# Altium project PCB_Project.PrjPcb (part 1 of 2)
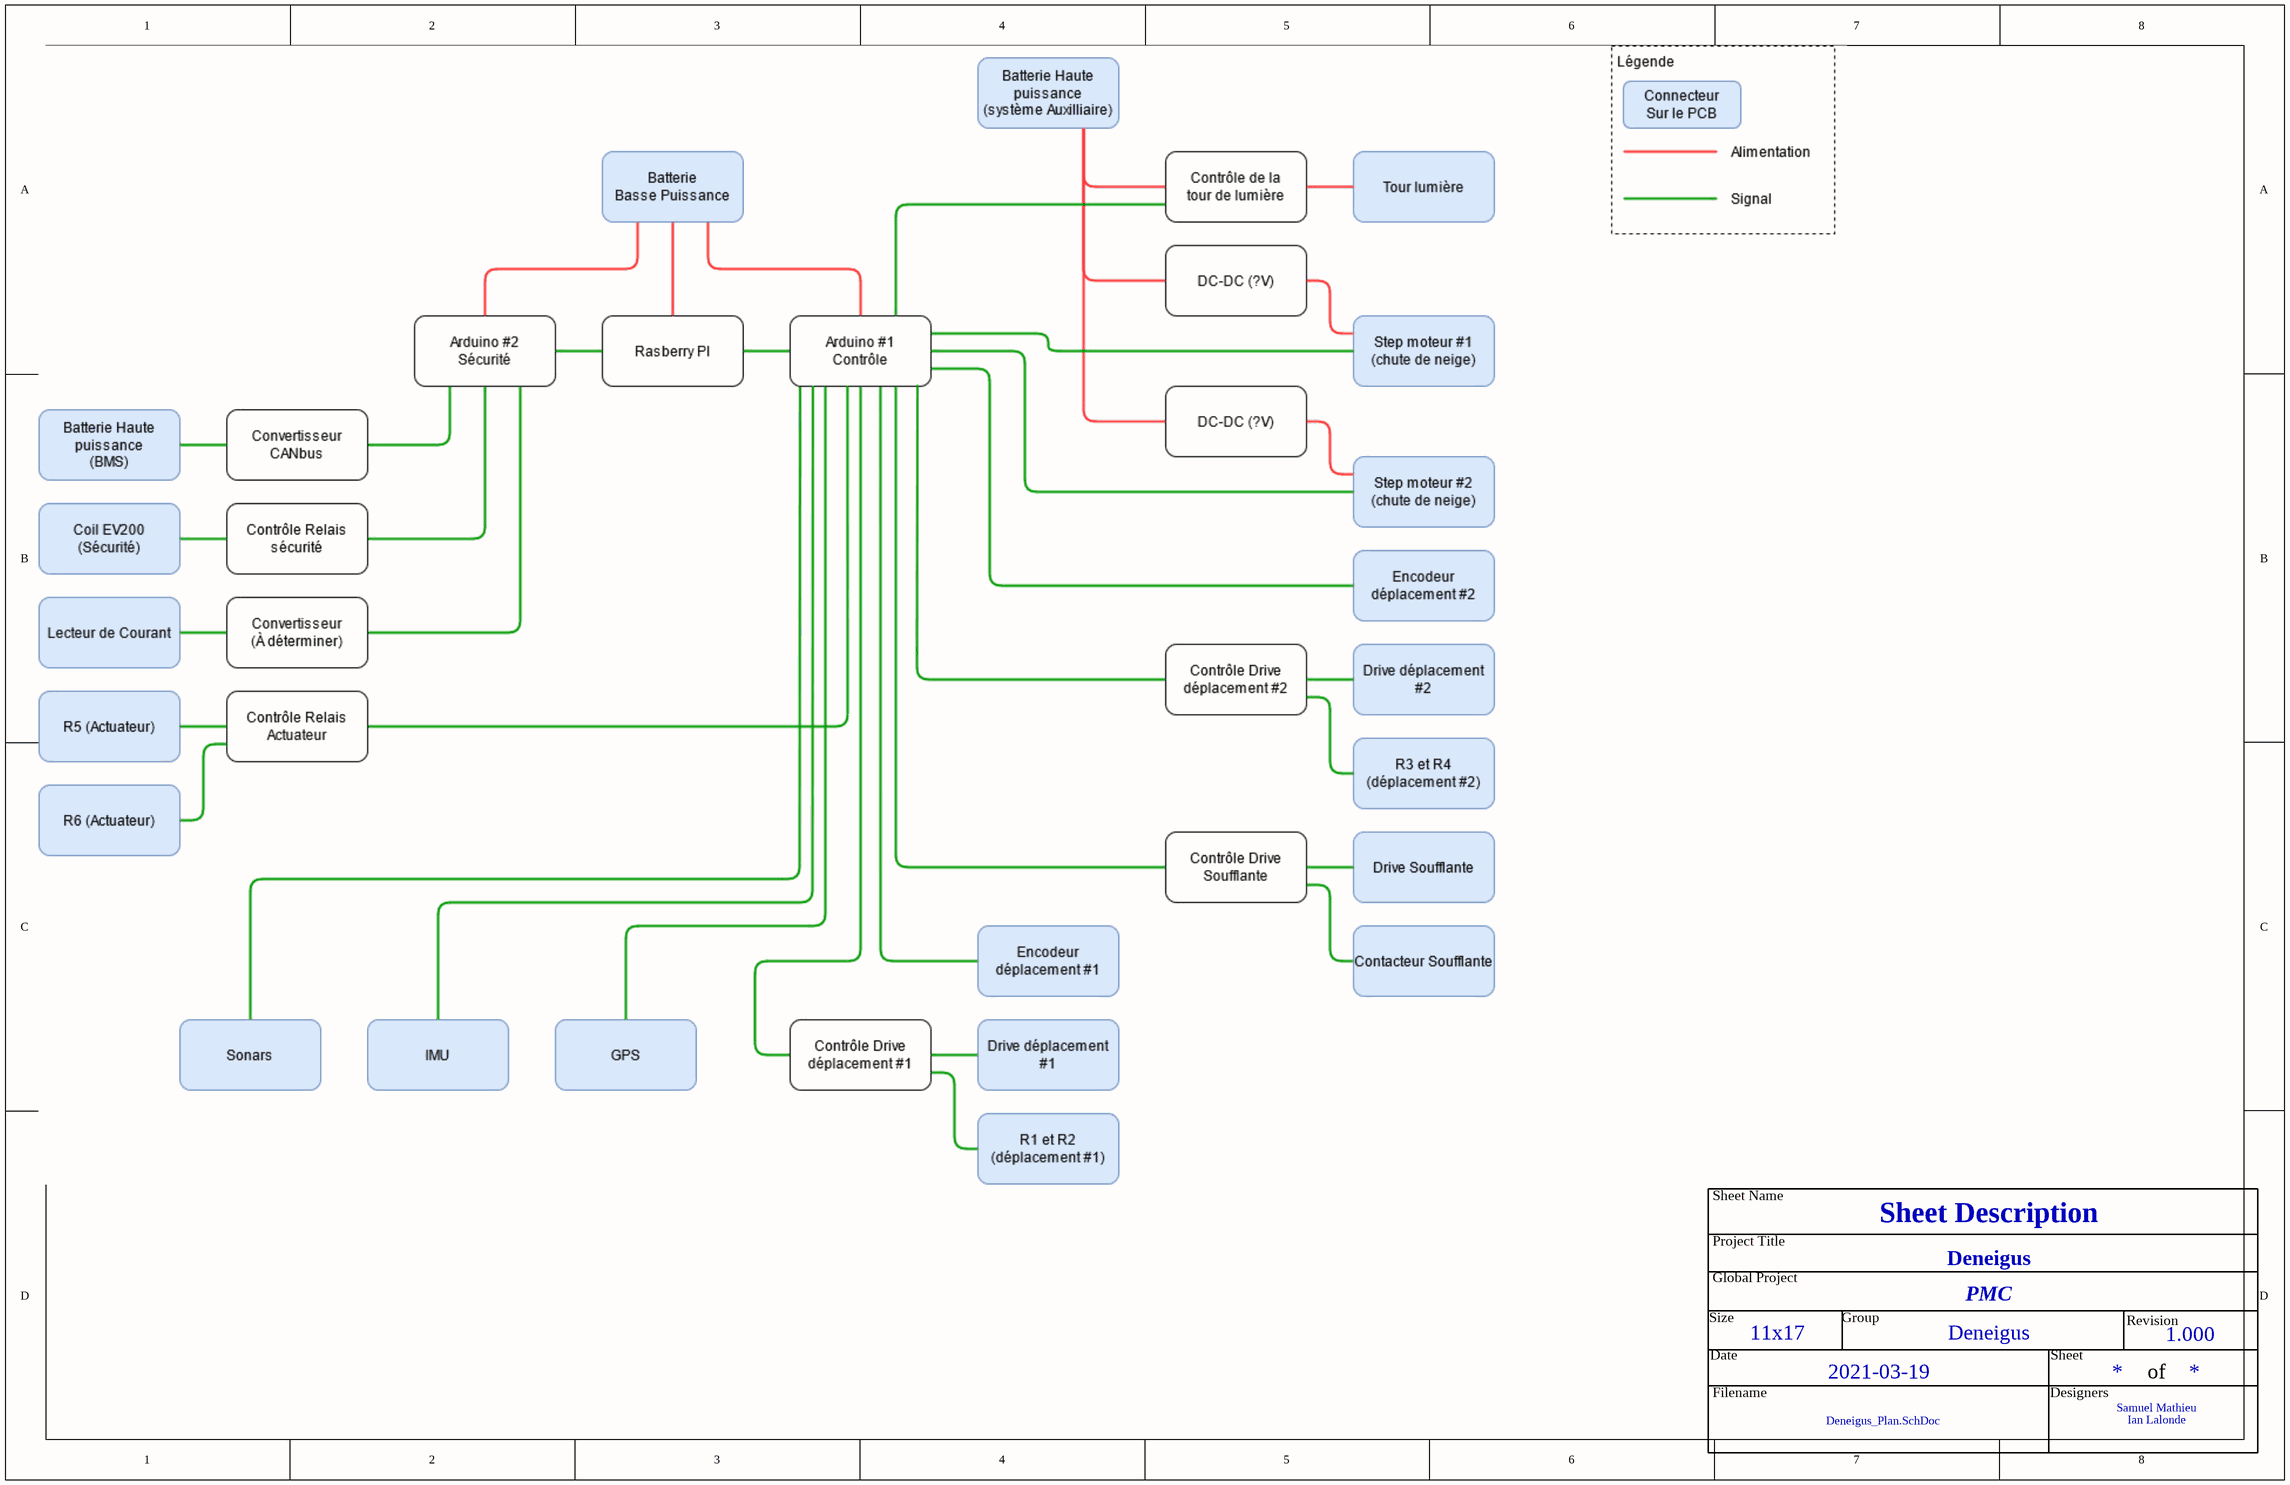
[diagram p0: Deneigus_Plan.SchDoc]
Project_Date: 2021-03-19; Project_DateCode: DCXXXX; Project_Designer1: Samuel Mathieu; Project_Designer2: Ian Lalonde; Project_Global: PMC; Project_Group: Deneigus; Project_Name: Deneigus; Project_Revision: 1.000; Project_Stencil_Bot_Thickness: 0.1 MM; Project_Stencil_Top_Thickness: 0.1 MM
10 sheets, 253 parts. Net scope: flat (ports and power ports of the same name join across sheets).
Board file: Deneigus.PcbDoc
Sheets:
  Deneigus_TITLE.SchDoc
  Deneigus_Plan.SchDoc
  Deneigus_MECHANICAL.SchDoc
  Deneigus_POWER.SchDoc
  Deneigus_Controle_Soufflante.SchDoc
  Deneigus_Controle_Deplacement.SchDoc
  Deneigus_Sensors.SchDoc
  Deneigus_PI_Arduino.SchDoc
  Deneigus_BMS.SchDoc
  Deneigus_Servo.SchDoc

## Sheet Deneigus_TITLE.SchDoc
size Tabloid; DocumentNumber: 1; SheetNumber: 1; SheetTotal: 11; Sheet_Name: Insert name in Document Parameters; Size: 11x17

### Notes on the sheet
- Revision history
- Package size conversion
- Metric
- 1005
- 1608
- Imperial
- 0402
- 0603
- Revision
- 2012
- 3216
- 0805
- 1206
- 3225
- 6432
- 1210
- 2512
- Date :
- Project Title
- Global Project
- Size
- Group
- Date
- Sheet
- of
- Filename
- Designers

## Sheet Deneigus_Plan.SchDoc
size Tabloid; Date: Date; Author: Author 1; Revision: 1; Size: 11x17; Sheet_Name: Sheet Description

### Notes on the sheet
- Sheet Name
- Project Title
- Global Project
- Revision
- Size
- Date
- Group
- Sheet
- of
- Filename
- Designers

## Sheet Deneigus_MECHANICAL.SchDoc
size Tabloid; Sheet_Name: Mechanical; Size: 11x17
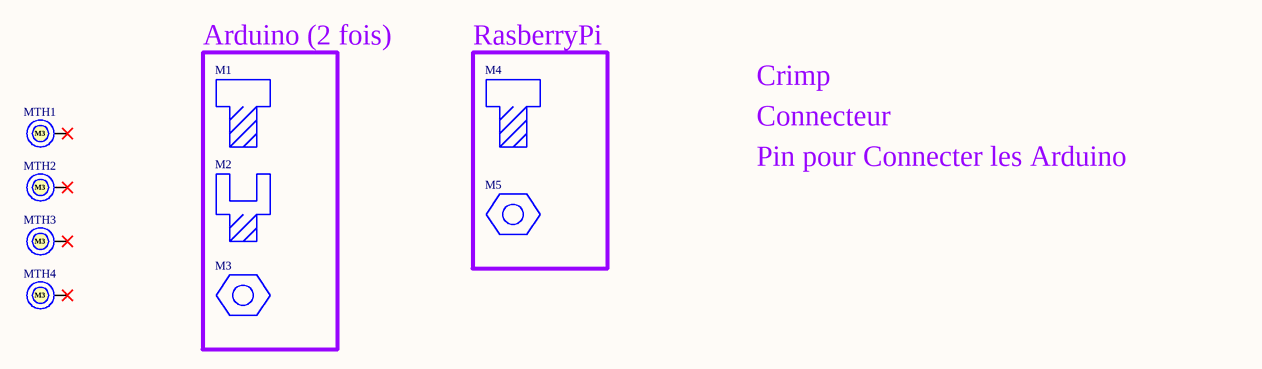
[diagram p1: Deneigus_MECHANICAL.SchDoc]

### Parts
M1  MACH SCREW PAN SLOTTED M3X0.5  (value not drawn)  (mechanical)
M2  HEX STANDOFF M3 NYLON 12MM  (value not drawn)  (mechanical)
M3  PLASTIC HEXAGON NUT M3  (value not drawn)  (mechanical)
M4  MACH SCREW PAN SLOTTED M2.5X0.45  (value not drawn)  (mechanical)
M5  PLASTIC HEXAGON NUT M2.5  (value not drawn)  (mechanical)
MTH1  M3  [MTH_M3]  (no BOM)
MTH2  M3  [MTH_M3]  (no BOM)
MTH3  M3  [MTH_M3]  (no BOM)
MTH4  M3  [MTH_M3]  (no BOM)

### Blocks framed on the sheet
Arduino (2 fois): M1-M3
RasberryPi: M4 M5

### Nets

Not connected (* = marked no-connect by the designer): MTH1 1*; MTH2 1*; MTH3 1*; MTH4 1*

### Notes on the sheet
- Crimp
- Connecteur
- Pin pour Connecter les Arduino
- Sheet Name
- Project Title
- Global Project
- Size
- Group
- Revision
- Date
- Sheet
- of
- Filename
- Designers

### Library data of the parts
M1 M4 = StandOff Screw: Supplier 1: Digi-Key
  M1: Supplier Part Number 1: 36-29341-ND; Quantity: 8
  M4: Quantity: 4; Supplier Part Number 1: 36-29334-ND
M2 = StandOff 12mm: Supplier 1: Digi-Key; Supplier Part Number 1: 36-25502-ND; Quantity: 8
M3 M5 = StandOff Nut: Supplier 1: Digi-Key
  M3: Supplier Part Number 1: 732-12637-ND; Quantity: 8
  M5: Quantity: 10; Supplier Part Number 1: 36-4687-ND
MTH1-MTH4 = MTH_M3: MTH - MOUNTING HOLE M3 PLATED - M3; GRAMS Lib Spec: 2.8; Magnetic Material: NO; Cryo: UNKNOWN; Value: *; Tolerance: *; Voltage Rating: *; Current Rating: *; Power Max: *; HelpURL: https://littlemachineshop.com/images/gallery/PDF/TapDrillSizes.pdf; CreatedBy/Date: Jonathan Bouchard 2018-07-23; VerifiedBy: Arnaud Samson 23-07-18; Temperature: *; Package: M3; Manufacturer #1: *; Manufacturer #2: *; Note: *; Assembly Type: NONE; Part Number #2: *; Part Number #1: *; Polarized: *; Supplier 1: *; Supplier Part Number 1: *

## Sheet Deneigus_POWER.SchDoc
size Tabloid; Sheet_Name: Power tree; Size: 11x17
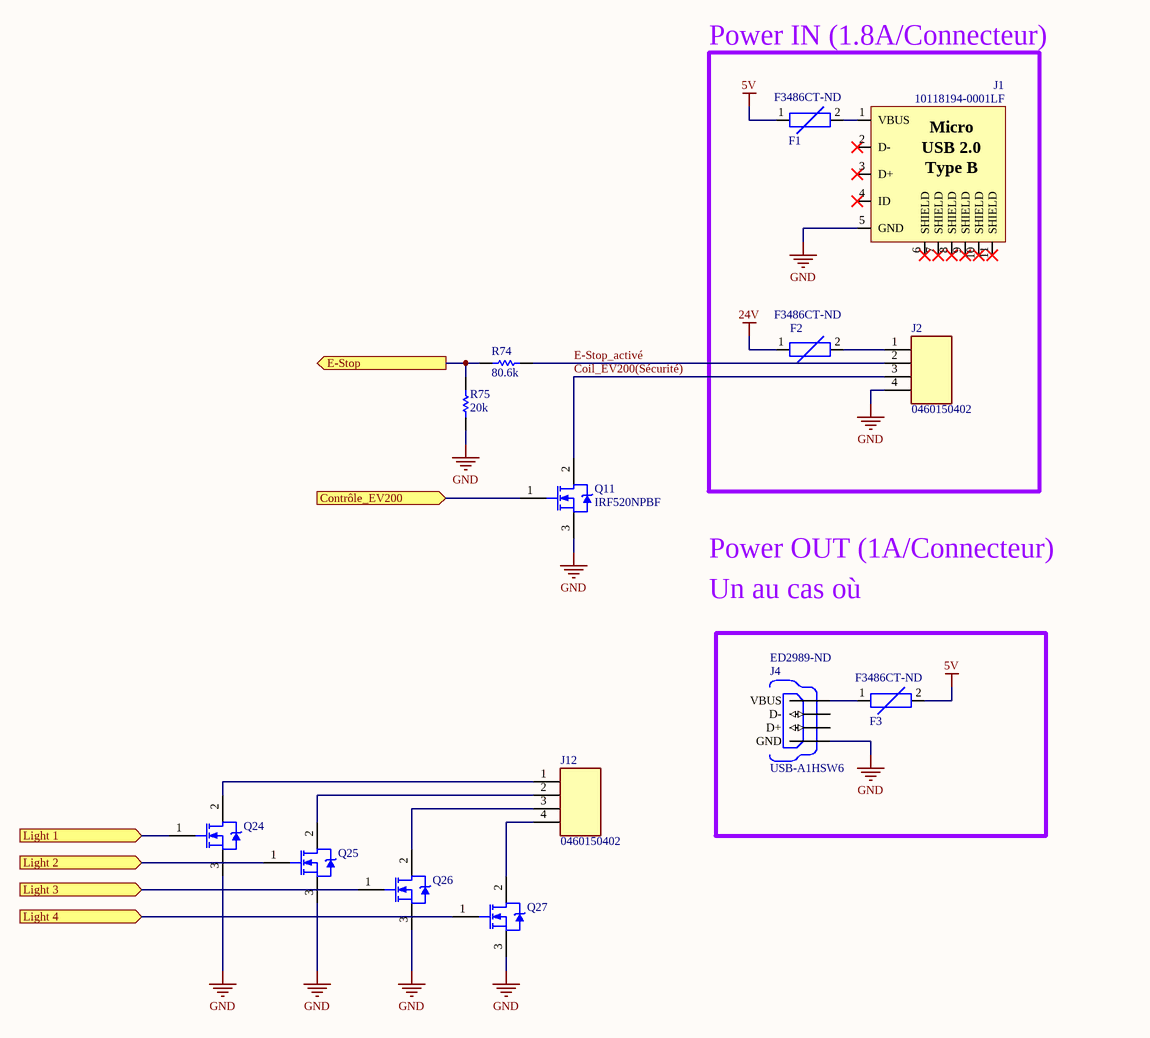
[diagram p2: Deneigus_POWER.SchDoc]

### Parts
F1  Supplier Part Number 1: F3486CT-ND  [1812 (4532 Metric)]  (hidden comment: 0ZCG0075BF2B)
F2  Supplier Part Number 1: F3486CT-ND  [1812 (4532 Metric)]  (hidden comment: 0ZCG0075BF2B)
F3  Supplier Part Number 1: F3486CT-ND  [1812 (4532 Metric)]  (hidden comment: 0ZCG0075BF2B)
J1  10118194-0001LF  [CON_USB_10118194-0001LF]
J2  0460150402  [Molex_4PIN]
J4  USB-A1HSW6  Supplier Part Number 1: ED2989-ND  [OST_USB-A1HSW6]
J12  0460150402  [Molex_4PIN]
Q11  IRF520NPBF  [INTR-TO-220AB-3]
Q24  IRF520NPBF  [INTR-TO-220AB-3]  (value not drawn)
Q25  IRF520NPBF  [INTR-TO-220AB-3]  (value not drawn)
Q26  IRF520NPBF  [INTR-TO-220AB-3]  (value not drawn)
Q27  IRF520NPBF  [INTR-TO-220AB-3]  (value not drawn)
R74  value 80.6k  [RES_0805]  (hidden comment: Res1)
R75  value 20k  [RES_0805]  (hidden comment: Res1)

### Blocks framed on the sheet
Power IN (1.8A/Connecteur): F1 F2 J1 J2

### Ports
Contrôle_EV200 (in), E-Stop (out), Light 1 (in), Light 2 (in), Light 3 (in), Light 4 (in)

### Nets
5V: F1.1 F3.2
24V: F2.1
GND: J1.5(GND) J2.4 J4.4(GND) Q11.3(S) Q24.3(S) Q25.3(S) Q26.3(S) Q27.3(S) R75.2
Coil_EV200(Sécurité): J2.3 Q11.2(D)
Contrôle_EV200: Q11.1(G) ; port Contrôle_EV200
E-Stop: R74.2 R75.1 ; port E-Stop
E-Stop_activé: J2.2 R74.1
Light 1: Q24.1(G) ; port Light 1
Light 2: Q25.1(G) ; port Light 2
Light 3: Q26.1(G) ; port Light 3
Light 4: Q27.1(G) ; port Light 4
NetF1_2: F1.2 J1.1(VBUS)
NetF2_2: F2.2 J2.1
NetF3_1: F3.1 J4.1(VBUS)
NetJ12_1: J12.1 Q24.2(D)
NetJ12_2: J12.2 Q25.2(D)
NetJ12_3: J12.3 Q26.2(D)
NetJ12_4: J12.4 Q27.2(D)

Not connected (* = marked no-connect by the designer): J1 2(D-)* 3(D+)* 4(ID)* 6(SHIELD)* 7(SHIELD)* 8(SHIELD)* 9(SHIELD)* 10(SHIELD)* 11(SHIELD)*; J4 2(D-) 3(D+)

### Notes on the sheet
- Power OUT (1A/Connecteur)
- Un au cas où
- Sheet Name
- Project Title
- Global Project
- Size
- Group
- Revision
- Date
- Sheet
- of
- Filename
- Designers
- (in symbol CON_USB_10118194-0001LF) Micro; USB 2.0; Type B

### Library data of the parts
F1-F3 = PTC 33V 750 mA: Max Voltage: 33V; Hold Current: 750mA; Supplier 1: Digi-Key
J1 = CON_USB_10118194-0001LF: CON - USB MICRO B RECPT SMT R/A - 4PIN; Manufacturer #1: Amphenol FCI; Value: USB - Micro B; Voltage Rating: 100VAC; Current Rating: 1.8A; GRAMS Lib Spec: 2.8; Magnetic Material: YES; Cryo: UNKNOWN; Tolerance: *; Power Max: *; HelpURL: https://cdn.amphenol-icc.com/media/wysiwyg/files/drawing/10118194.pdf; CreatedBy/Date: Arnaud Samson - 09/07/18; VerifiedBy: Jonathan Bouchard 2018-07-12; Temperature: -30°C ~ 80°C; Package: 5-SMD; Manufacturer #2: *; Note: *; Assembly Type: SMD; Part Number #2: *; Part Number #1: 10118194-0001LF; Polarized: YES; Supplier 1: Digi-Key; Supplier Part Number 1: 609-4618-1-ND
J2 J12 = Molex_4PIN: Supplier 1: Digi-Key; Supplier Part Number 1: WM3844-ND
J4 = USB-A1HSW6: USB-A _USB TYPE-A_  Receptacle Connector 4 Position Through Hole, Right Angle; MF: On Shore; SnapEDA_Link: https://www.snapeda.com/parts/USB-A1HSW6/On%20Shore%20Technology%20Inc./view-part/13110/?ref=snap; Package: None; MP: USB-A1HSW6; Availability: Unavailable; Price: None; Value: *; Supplier 1: Digi-Key
Q11 Q24-Q27 = CMP-013-00017-4: HEXFET(R) Power MOSFET, 100 V, 9.7 A, 0.2 Ohm, -55 to 175 degC, 3-Pin FM (TO-220AB), RoHS, Tube; Manufacturer: International Rectifier; Power: 48W; Elements: 1; Typical Rise Time: 23ns; Nominal Dual Supply Voltage: 100V; Rds On Max: 200mohm; Input Capacitance: 330pF; Nominal Vgs: 4V; Package Reference: TO-220AB; Max Operating Temperature: 175°C; Datasheet Version: Nov-03; Datasheet URL: http://www.infineon.com/dgdl/irf520npbf.pdf?fileId=5546d462533600a4015355e340711985; Package Quantity: 50; Package Description: 3-Pin Flange Mount, Body 4.445 x 10.415 mm, Pitch 2.54 mm; Pins: 3; Packaging: Rail/Tube; RoHS Compliant: True; Min Operating Temperature: -55°C; Case/Package: TO-220-3; Mounting Technology: TH
R74 R75 = Res1: Resistor; Published: 8-Jun-2000; LatestRevisionDate: 17-Jul-2002; LatestRevisionNote: Re-released for DXP Platform.; PackageReference: AXIAL-0.3; Publisher: Altium Limited; PackageDescription: Axial Device, Thru-Hole; 2 Leads; 0.3 in Pin Spacing

## Sheet Deneigus_Controle_Soufflante.SchDoc
size Tabloid; Date: Date; Author: Author 1; Revision: 1; Size: 11x17; Sheet_Name: Interface Soufflante
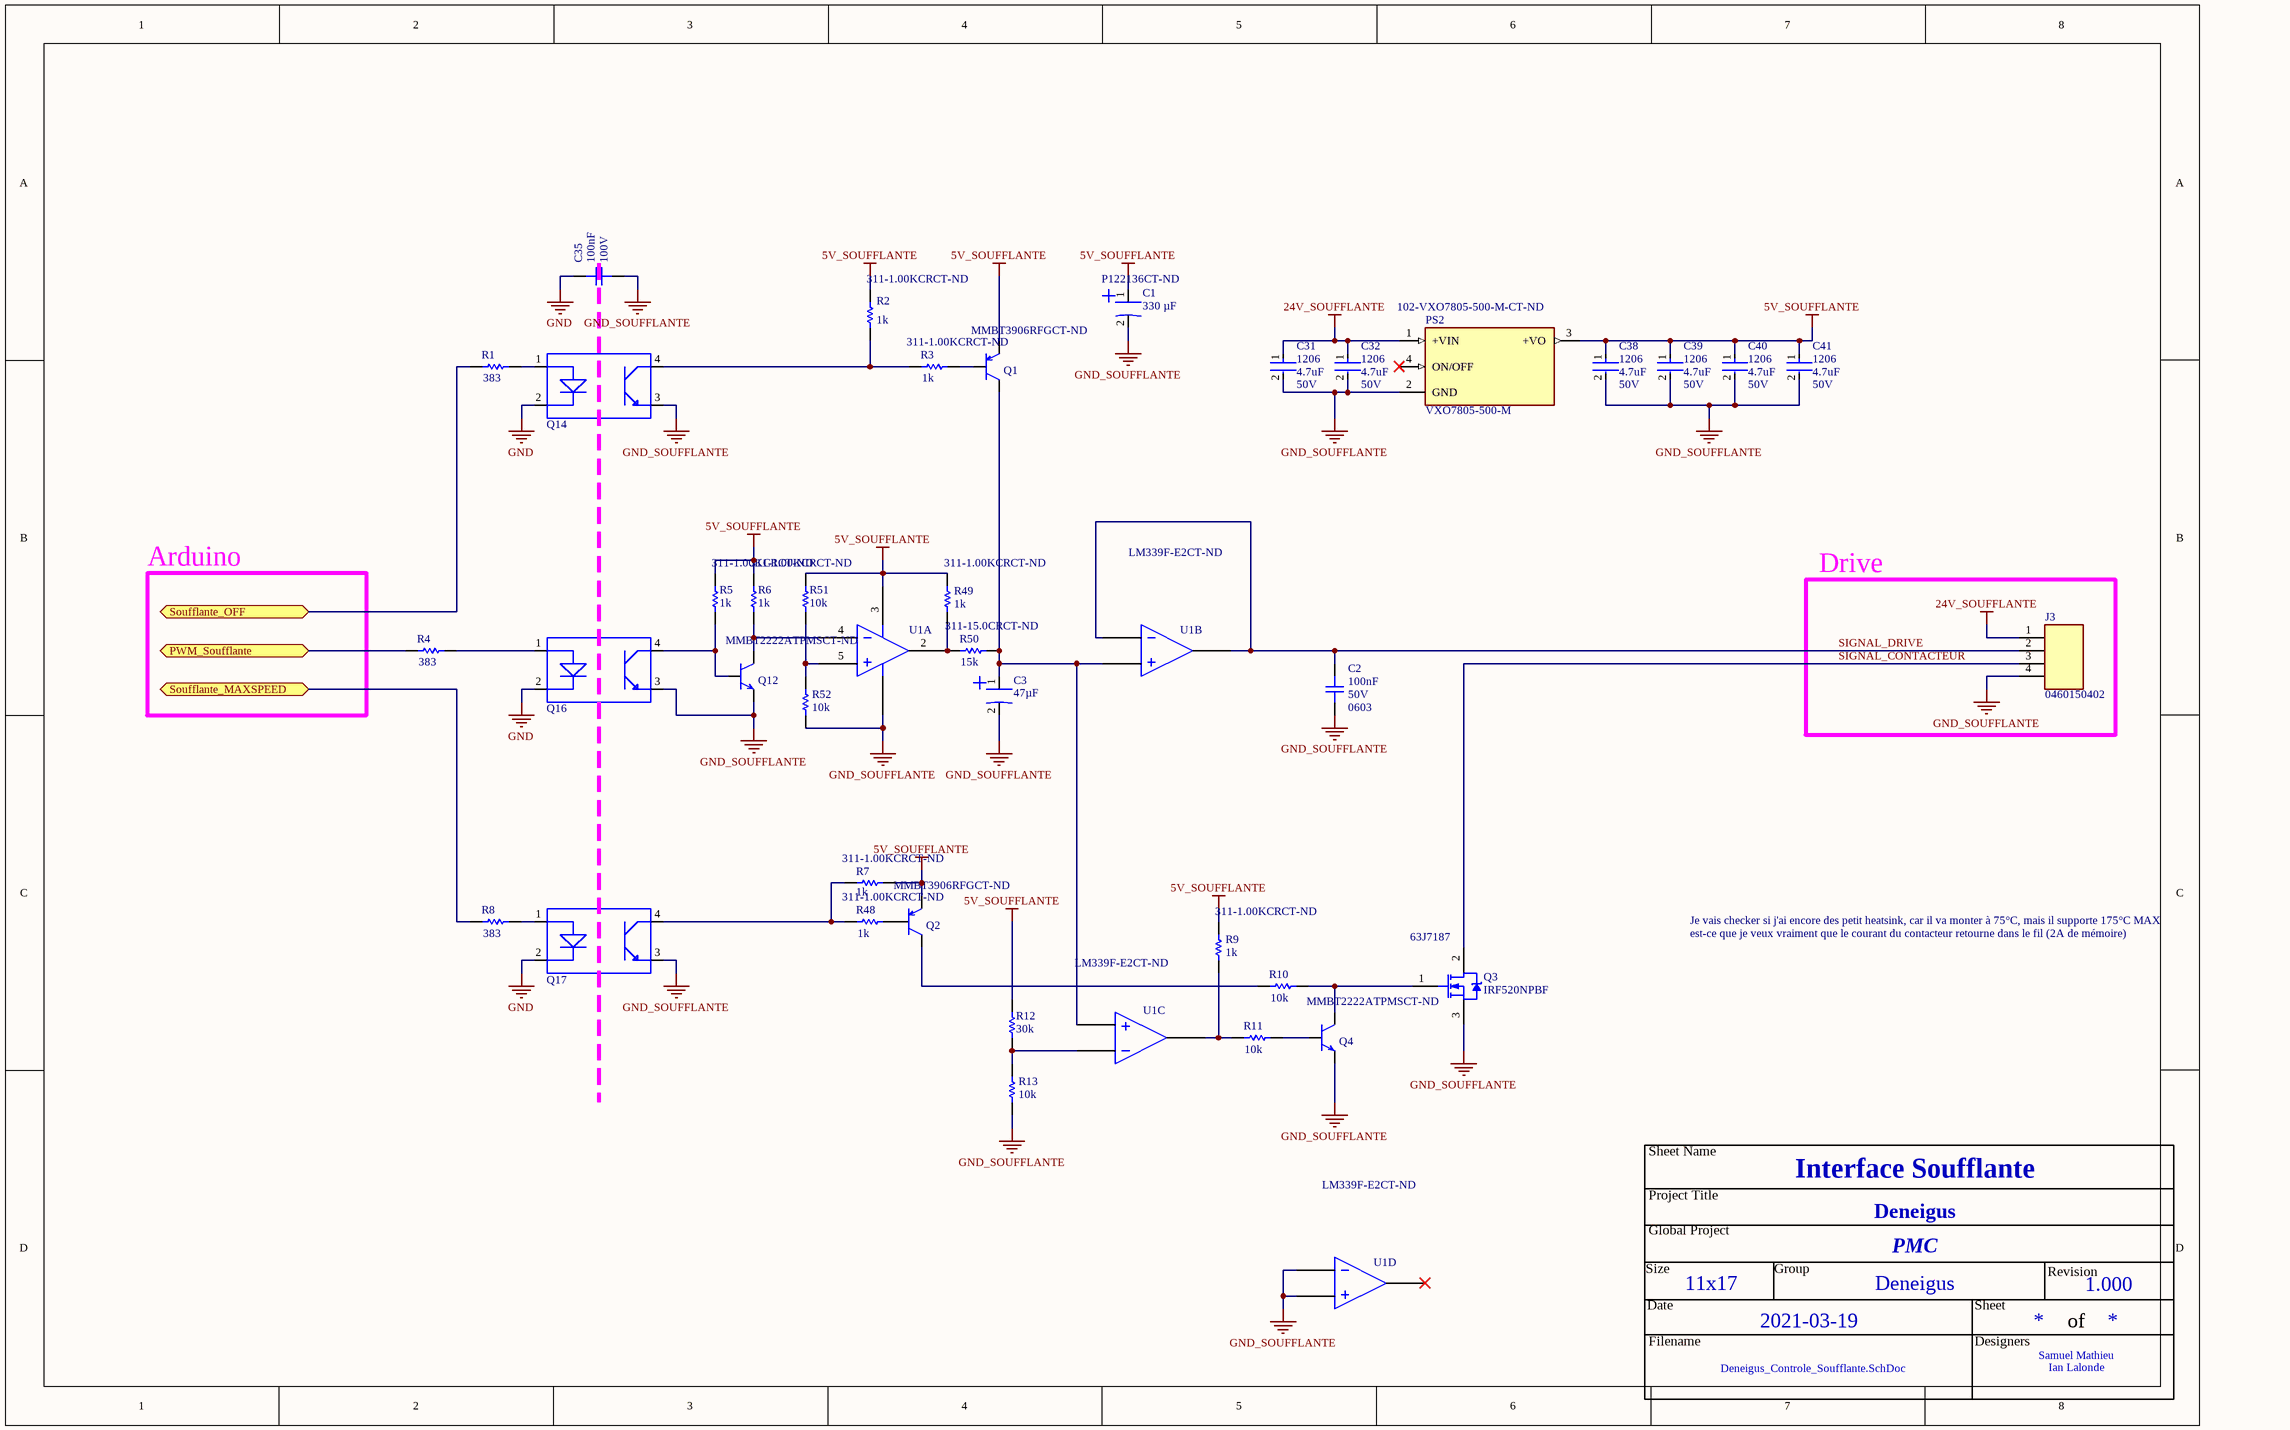
[diagram p3: Deneigus_Controle_Soufflante.SchDoc]

### Parts
C1  value 330 µF  Supplier Part Number 1: P122136CT-ND  [330uF (10.3x10.3mm)]  (hidden comment: CAP ALUM POLY 47UF 20% 16V SMD)
C2  value 100nF  Voltage: 50V  Package: 0603  [CAP_0603]  (hidden comment: CAP - 0603)
C3  value 47µF  [47uF]  (hidden comment: CAP ALUM POLY 47UF 20% 16V SMD)
C31  Case/Package: 1206  Voltage Rating: 50V  Capacitance: 4.7uF  [FP-CL31-IPC_C]  (hidden comment: CL31B475KBHNFNE)
C32  Case/Package: 1206  Voltage Rating: 50V  Capacitance: 4.7uF  [FP-CL31-IPC_C]  (hidden comment: CL31B475KBHNFNE)
C35  value 100nF  Voltage: 100V  [CAP_0805]  (hidden comment: CAP - 0805)
C38  Case/Package: 1206  Voltage Rating: 50V  Capacitance: 4.7uF  [FP-CL31-IPC_C]  (hidden comment: CL31B475KBHNFNE)
C39  Case/Package: 1206  Voltage Rating: 50V  Capacitance: 4.7uF  [FP-CL31-IPC_C]  (hidden comment: CL31B475KBHNFNE)
C40  Case/Package: 1206  Voltage Rating: 50V  Capacitance: 4.7uF  [FP-CL31-IPC_C]  (hidden comment: CL31B475KBHNFNE)
C41  Case/Package: 1206  Voltage Rating: 50V  Capacitance: 4.7uF  [FP-CL31-IPC_C]  (hidden comment: CL31B475KBHNFNE)
J3  0460150402  [Molex_4PIN]
PS2  VXO7805-500-M  Supplier Part Number 1: 102-VXO7805-500-M-CT-ND  [CONV_VXO7805-500-M]
Q1  Supplier Part Number 1: MMBT3906RFGCT-ND  [SOT-23]  (hidden comment: TRANS PNP 40V 0.2A SOT23)
Q2  Supplier Part Number 1: MMBT3906RFGCT-ND  [SOT-23]  (hidden comment: TRANS PNP 40V 0.2A SOT23)
Q3  IRF520NPBF  Supplier Part Number 1: 63J7187  [INTR-TO-220AB-3]
Q4  Supplier Part Number 1: MMBT2222ATPMSCT-ND  [SOT-23]  (hidden comment: TRANS NPN 40V 0.2A SOT23)
Q12  Supplier Part Number 1: MMBT2222ATPMSCT-ND  [SOT-23]  (hidden comment: TRANS NPN 40V 0.2A SOT23)
Q14  WL-OCPT OPTOCOUPLER PHOTOTRANSIS  [WL-OCPT OPTOCOUPLER PHOTOTRANSIS]  (value not drawn)
Q16  WL-OCPT OPTOCOUPLER PHOTOTRANSIS  [WL-OCPT OPTOCOUPLER PHOTOTRANSIS]  (value not drawn)
Q17  WL-OCPT OPTOCOUPLER PHOTOTRANSIS  [WL-OCPT OPTOCOUPLER PHOTOTRANSIS]  (value not drawn)
R1  value 383  [RES_0805]  (hidden comment: Res1)
R2  value 1k  Supplier Part Number 1: 311-1.00KCRCT-ND  [RES_0805]  (hidden comment: Res1)
R3  value 1k  Supplier Part Number 1: 311-1.00KCRCT-ND  [RES_0805]  (hidden comment: Res1)
R4  value 383  [RES_0805]  (hidden comment: Res1)
R5  value 1k  Supplier Part Number 1: 311-1.00KCRCT-ND  [RES_0805]  (hidden comment: Res1)
R6  value 1k  Supplier Part Number 1: 311-1.00KCRCT-ND  [RES_0805]  (hidden comment: Res1)
R7  value 1k  Supplier Part Number 1: 311-1.00KCRCT-ND  [RES_0805]  (hidden comment: Res1)
R8  value 383  [RES_0805]  (hidden comment: Res1)
R9  value 1k  Supplier Part Number 1: 311-1.00KCRCT-ND  [RES_0805]  (hidden comment: Res1)
R10  value 10k  [RES_0805]  (hidden comment: Res1)
R11  value 10k  [RES_0805]  (hidden comment: Res1)
R12  value 30k  [RES_0805]  (hidden comment: Res1)
R13  value 10k  [RES_0805]  (hidden comment: Res1)
R48  value 1k  Supplier Part Number 1: 311-1.00KCRCT-ND  [RES_0805]  (hidden comment: Res1)
R49  value 1k  Supplier Part Number 1: 311-1.00KCRCT-ND  [RES_0805]  (hidden comment: Res1)
R50  value 15k  Supplier Part Number 1: 311-15.0CRCT-ND  [RES_0805]  (hidden comment: Res1)
R51  value 10k  [RES_0805]  (hidden comment: Res1)
R52  value 10k  [RES_0805]  (hidden comment: Res1)
U1  LM339  [SOP14]  (value not drawn)  (parts A,B,C,D of 4)

### Blocks framed on the sheet
Drive: J3

### Ports
PWM_Soufflante (bidir), Soufflante_MAXSPEED (bidir), Soufflante_OFF (bidir)

### Nets
5V_SOUFFLANTE: C1.1 C38.1 C39.1 C40.1 C41.1 PS2.3(+VO) Q1.2 Q2.2 R2.1 R5.2 R6.2 R7.1 R9.2 R12.2 R49.1 R51.2 U1.3
24V_SOUFFLANTE: C31.1 C32.1 J3.1 PS2.1(+VIN)
GND: C35.2 Q14.2 Q16.2 Q17.2
GND_SOUFFLANTE: C1.2 C2.1 C3.2 C31.2 C32.2 C35.1 C38.2 C39.2 C40.2 C41.2 J3.4 PS2.2(GND) Q3.3(S) Q4.2 Q12.2 Q14.3 Q16.3 Q17.3 R13.1 R52.1 U1.10 U1.11 U1.12
PWM_Soufflante: R4.1 ; port PWM_Soufflante
SIGNAL_CONTACTEUR: J3.3 Q3.2(D)
SIGNAL_DRIVE: C2.2 J3.2 U1.1 U1.6
Soufflante_MAXSPEED: R8.1 ; port Soufflante_MAXSPEED
Soufflante_OFF: R1.1 ; port Soufflante_OFF
NetC3_1: C3.1 Q1.3 R50.2 U1.7 U1.9
NetQ1_1: Q1.1 R3.2
NetQ2_1: Q2.1 R48.2
NetQ2_3: Q2.3 R10.2
NetQ3_1: Q3.1(G) Q4.3 R10.1
NetQ4_1: Q4.1 R11.2
NetQ12_1: Q12.1 Q16.4 R5.1
NetQ12_3: Q12.3 R6.1 U1.4
NetQ14_1: Q14.1 R1.2
NetQ14_4: Q14.4 R2.2 R3.1
NetQ16_1: Q16.1 R4.2
NetQ17_1: Q17.1 R8.2
NetQ17_4: Q17.4 R7.2 R48.1
NetR9_1: R9.1 R11.1 U1.14
NetR12_1: R12.1 R13.2 U1.8
NetR49_2: R49.2 R50.1 U1.2
NetR51_1: R51.1 R52.2 U1.5

Not connected (* = marked no-connect by the designer): PS2 4(ON/OFF)*; U1 13*

### Notes on the sheet
- Arduino
- Je vais checker si j'ai encore des petit heatsink, car il va monter à 75°C, mais il supporte 175°C MAX
- est-ce que je veux vraiment que le courant du contacteur retourne dans le fil (2A de mémoire)
- Sheet Name
- Project Title
- Global Project
- Revision
- Size
- Date
- Group
- Sheet
- of
- Filename
- Designers

### Library data of the parts
C1 C3 = 47µF SMD: Mfg Part Number: 875105344006; Mfg: Würth Elektronik; HelpURL: https://www.we-online.de/katalog/datasheet/875105344006.pdf
  C1: Supplier 1: Digi-Key
  C3: Supplier 1: Digikey; Supplier Part Number 1: 732-6421-2-ND
C2 = CAP - 0603: Precision: 10%; Current: *; CreatedBy: Jonathan Bouchard; Power: *
C31 C32 C38-C41 = CMP-13271-001123-1: Cap Ceramic 4.7uF 50V X7R ±10% SMD 1206 +125°C Embossed T/R; Depth: 1.6mm; Max Operating Temperature: 125°C; Case Code (Metric): 3216; Packaging: Tape and Reel; Mount: Surface Mount; Min Operating Temperature: -55°C; Thickness: 0.071inch; Length: 3.2mm; Dielectric: X7R; Case Code (Imperial): 1206; Height: 1.6mm; Package Quantity: 1; Tolerance: 10%; Radiation Hardening: No; Width: 0.063inch
C35 = CAP - 0805: Mfg Part Number: GRM21BR61H106ME43L; Mfg: Murata Electronics; Precision: 10%; Current: *; CreatedBy: Jonathan Bouchard; Power: *; Package: 0805; Supplier 1: Digi-Key; Supplier Part Number 1: 490-5825-1-ND
J3 = Molex_4PIN: Supplier 1: Digi-Key; Supplier Part Number 1: WM3844-ND
PS2 = VXO7805-500-M: 500 mA Output Current, 4.75~36 Vdc Input, SMT, Non-Isolated, Dc-Dc Converter; MF: CUI Inc.; Value: *; Price: None; MP: VXO7805-500-M; SnapEDA_Link: https://www.snapeda.com/parts/VXO7805-500-M/CUI%20Inc./view-part/4703817/?ref=snap; Package: SMD-4; Availability: Unavailable; Supplier 1: Digi-Key
Q1 Q2 = PNP 3906 SMD: Trans GP BJT PNP 40V 0.2A 3-Pin SOT-23 T/R; Manufacturer: MCC; Manufacturer Part Number: MMBT3906-TP; Number of Elements: 1; hFE Min: 60; Max Power Dissipation: 300mW; Frequency: 250MHz; Max Collector Current: 200mA; Emitter Base Voltage (VEBO): 5V; Collector Emitter Saturation Voltage: -250mV; Element Configuration: Single; Current Rating: -2A; Voltage Rating (DC): -40V; Collector-emitter Voltage-Max: 400mV; RoHS: Yes; Category: BJTs; Stock 1: 96763; Pricing 1: 1=0.14000, 10=0.09700, 25=0.09320, 100=0.05250, 500=0.04122, 1000=0.02862 (USD); Mount: Surface Mount; Case/Package: SOT-23; Number of Pins: 3; Min Operating Temperature: -55°C; Max Operating Temperature: 150°C; Package Quantity: 1; Collector Emitter Voltage (VCEO): 40V; Packaging: Tape and Reel; Transition Frequency: 250MHz; Collector Emitter Breakdown Voltage: 40V; Max Breakdown Voltage: 40V; Polarity: PNP; Collector Base Voltage (VCBO): 40V; Power Dissipation: 300mW; Max Frequency: 250MHz; Gain Bandwidth Product: 250MHz; Series: -; Length: 3.04mm; Width: 1.4mm; Height: 1.12mm; Radiation Hardening: No; Lead Free: Lead Free; ComponentLink1URL: https://datasheet.ciiva.com/6362/mmbt3906sot-23-6362513.pdf?src-supplier=Digi-Key; ComponentLink1Description: https://datasheet.ciiva.com/6362/mmbt3906sot-23-6362513.pdf?src-supplier=Digi-Key; ComponentLink2URL: https://datasheet.ciiva.com/15200/getdatasheetpartid-321202-15200524.pdf?src-supplier=Verical; ComponentLink2Description: https://datasheet.ciiva.com/15200/getdatasheetpartid-321202-15200524.pdf?src-supplier=Verical; Supplier 1: Digi-Key
Q3 = CMP-013-00017-4: HEXFET(R) Power MOSFET, 100 V, 9.7 A, 0.2 Ohm, -55 to 175 degC, 3-Pin FM (TO-220AB), RoHS, Tube; Manufacturer: International Rectifier; Manufacturer Part Number: IRF1404PBF; Power: 48W; Elements: 1; Typical Rise Time: 23ns; Nominal Dual Supply Voltage: 100V; Rds On Max: 200mohm; Input Capacitance: 330pF; Nominal Vgs: 4V; Continuous Drain Current (ID): 202A; Gate to Source Voltage (Vgs): 20V; Rise Time: 190ns; Turn-On Delay Time: 17ns; Turn-Off Delay Time: 46ns; Fall Time: 33ns; Power Dissipation: 333W; Drain to Source Breakdown Voltage: 40V; Drain to Source Resistance: 4mR; Recovery Time: 117ns; Element Configuration: Single; Current Rating: 162A; Package Reference: TO-220AB; Max Operating Temperature: 175°C; Datasheet Version: Nov-03; Datasheet URL: http://www.infineon.com/dgdl/irf520npbf.pdf?fileId=5546d462533600a4015355e340711985; Package Quantity: 50; Package Description: 3-Pin Flange Mount, Body 4.445 x 10.415 mm, Pitch 2.54 mm; Pins: 3; Packaging: Rail/Tube; RoHS Compliant: True; Min Operating Temperature: -55°C; Case/Package: TO-220-3; Mounting Technology: TH; Supplier 1: Digikey; RoHS: Yes; Category: MOSFETs; Stock 1: 216; Pricing 1: 1=1.79000, 10=1.54000, 100=1.26000, 500=1.12000, 1000=0.96000 (USD); Mount: Through Hole; Number of Pins: 3; Number of Elements: 1; Max Power Dissipation: 333W; Drain to Source Voltage (Vdss): 40V; Series: HEXFET®; Dual Supply Voltage: 40V; On-State Resistance: 4mR; Termination: Through Hole; Threshold Voltage: 4V; Voltage Rating (DC): 40V; Drain-source On Resistance-Max: 4mR; Length: 10.67mm; Width: 4.83mm; Height: 8.77mm; Lead Pitch: 2.54mm; Radiation Hardening: No; REACH SVHC: No SVHC; Lead Free: Lead Free; ComponentLink1URL: https://datasheet.ciiva.com/7935/irf1404-7935436.pdf?src-supplier=Element14; ComponentLink1Description: https://datasheet.ciiva.com/7935/irf1404-7935436.pdf?src-supplier=Element14; ComponentLink2URL: https://datasheet.ciiva.com/19479/1559551-19479743.pdf?src-supplier=Jameco; ComponentLink2Description: https://datasheet.ciiva.com/19479/1559551-19479743.pdf?src-supplier=Jameco; ComponentLink3URL: https://datasheet.ciiva.com/17323/irf1404pbf-17323123.pdf?src-supplier=Avnet+Europe; ComponentLink3Description: https://datasheet.ciiva.com/17323/irf1404pbf-17323123.pdf?src-supplier=Avnet+Europe; ComponentLink4URL: https://datasheet.ciiva.com/939/irf1404pbf-939787.pdf?src-supplier=Digi-Key; ComponentLink4Description: https://datasheet.ciiva.com/939/irf1404pbf-939787.pdf?src-supplier=Digi-Key; ComponentLink5URL: https://datasheet.ciiva.com/16378/irf1404pbf-16378907.pdf?src-supplier=Future+Electronics; ComponentLink5Description: https://datasheet.ciiva.com/16378/irf1404pbf-16378907.pdf?src-supplier=Future+Electronics
Q4 Q12 = NPN 3904 SMD: Transistor: 200mA 200mW NPN General-Purpose Amplifier, SOT-23, 7IN. Reel; Manufacturer: MCC; Manufacturer Part Number: MMBT3904-TP; Max Power Dissipation: 350mW; Number of Elements: 1; hFE Min: 40; Frequency: 300MHz; Collector Base Voltage (VCBO): 60V; Emitter Base Voltage (VEBO): 6V; Collector Emitter Saturation Voltage: 300mV; Element Configuration: Single; Current Rating: 100mA; RoHS: Yes; Category: BJTs; Stock 1: 949449; Pricing 1: 1=0.10000, 10=0.08100, 25=0.07680, 100=0.04400, 500=0.02706, 1000=0.01844 (USD); Mount: Surface Mount; Case/Package: SOT-23; Number of Pins: 3; Min Operating Temperature: -55°C; Max Operating Temperature: 150°C; Package Quantity: 1; Collector Emitter Voltage (VCEO): 40V; Packaging: Tape and Reel; Max Collector Current: 200mA; Transition Frequency: 300MHz; Collector Emitter Breakdown Voltage: 40V; Polarity: NPN; Max Breakdown Voltage: 40V; Power Dissipation: 350mW; Max Frequency: 300MHz; Gain Bandwidth Product: 300MHz; Voltage Rating (DC): 40V; Series: -; Collector-emitter Voltage-Max: 300mV; Length: 3.04mm; Width: 1.4mm; Height: 1.12mm; Radiation Hardening: No; Lead Free: Lead Free; RoHS Compliant: Yes; ComponentLink1URL: https://datasheet.ciiva.com/972/mmbt3904sot-23-972515.pdf?src-supplier=Digi-Key; ComponentLink1Description: https://datasheet.ciiva.com/972/mmbt3904sot-23-972515.pdf?src-supplier=Digi-Key; ComponentLink2URL: https://datasheet.ciiva.com/16291/mmbt3904sot-23-37005-16291911.pdf?src-supplier=Mouser; ComponentLink2Description: https://datasheet.ciiva.com/16291/mmbt3904sot-23-37005-16291911.pdf?src-supplier=Mouser; ComponentLink3URL: https://datasheet.ciiva.com/15139/getdatasheetpartid-251950-15139820.pdf?src-supplier=Verical; ComponentLink3Description: https://datasheet.ciiva.com/15139/getdatasheetpartid-251950-15139820.pdf?src-supplier=Verical; ComponentLink4URL: https://datasheet.ciiva.com/972/mmbt3904sot-23-972516.pdf?src-supplier=Digi-Key; ComponentLink4Description: https://datasheet.ciiva.com/972/mmbt3904sot-23-972516.pdf?src-supplier=Digi-Key; ComponentLink5URL: https://datasheet.ciiva.com/16742/mmbt3904tsot-523-16742101.pdf?src-supplier=Future+Electronics; ComponentLink5Description: https://datasheet.ciiva.com/16742/mmbt3904tsot-523-16742101.pdf?src-supplier=Future+Electronics; ComponentLink6URL: https://datasheet.ciiva.com/14546/70055699-14546053.pdf?src-supplier=Allied+Electronics; ComponentLink6Description: https://datasheet.ciiva.com/14546/70055699-14546053.pdf?src-supplier=Allied+Electronics; Supplier 1: Digi-Key
Q14 Q16 Q17 = WL-OCPT OPTOCOUPLER PHOTOTRANSIS: Optoisolator Transistor Output 3750Vrms 1 Channel 4-SOP; Supplier 1: Digi-Key; Supplier Part Number 1: 732-140357145400CT-ND
R1-R13 R48-R52 = Res1: Resistor; Published: 8-Jun-2000; LatestRevisionDate: 17-Jul-2002; LatestRevisionNote: Re-released for DXP Platform.; PackageReference: AXIAL-0.3; Publisher: Altium Limited; PackageDescription: Axial Device, Thru-Hole; 2 Leads; 0.3 in Pin Spacing
  R2 R3 R5-R7 R9 R48-R50: Supplier 1: Digi-Key
U1 = LM339: Comparator Quad ±16V/32V 14-Pin SOP T/R; Mfg Part Number: LM339F-E2; Manufacturer: Rohm; Voltage: 1.14 V ~ 1.26 V; Mfg: Rohm Semiconductor; Current: *; Power: *; HelpURL: https://d1d2qsbl8m0m72.cloudfront.net/en/products/databook/datasheet/ic/amp_linear/comparator/lm393f-e.pdf; CreatedBy: Samuel Mathieu; Temperature: -40°C ~ 85°C; Value: *; Precision: *; Package: BGA-676; Supplier 1: Digikey; Supplier Part Number 1: LM339F-E2TR-ND; Supplier 2: Digi-Key; Manufacturer Part Number: LM339F-E2; RoHS: Yes; Category: Comparators; Stock 2: 2211; Pricing 2: 1=0.96000, 10=0.84900, 25=0.79720, 100=0.65060, 250=0.60432, 500=0.51432, 1000=0.41145 (USD); RoHS Compliant: Yes; Supplier Part Number 2: LM339F-E2CT-ND

## Sheet Deneigus_Controle_Deplacement.SchDoc
size Tabloid; Date: Date; Author: Author 1; Revision: 1; Size: 11x17; Sheet_Name: Interface Déplacement
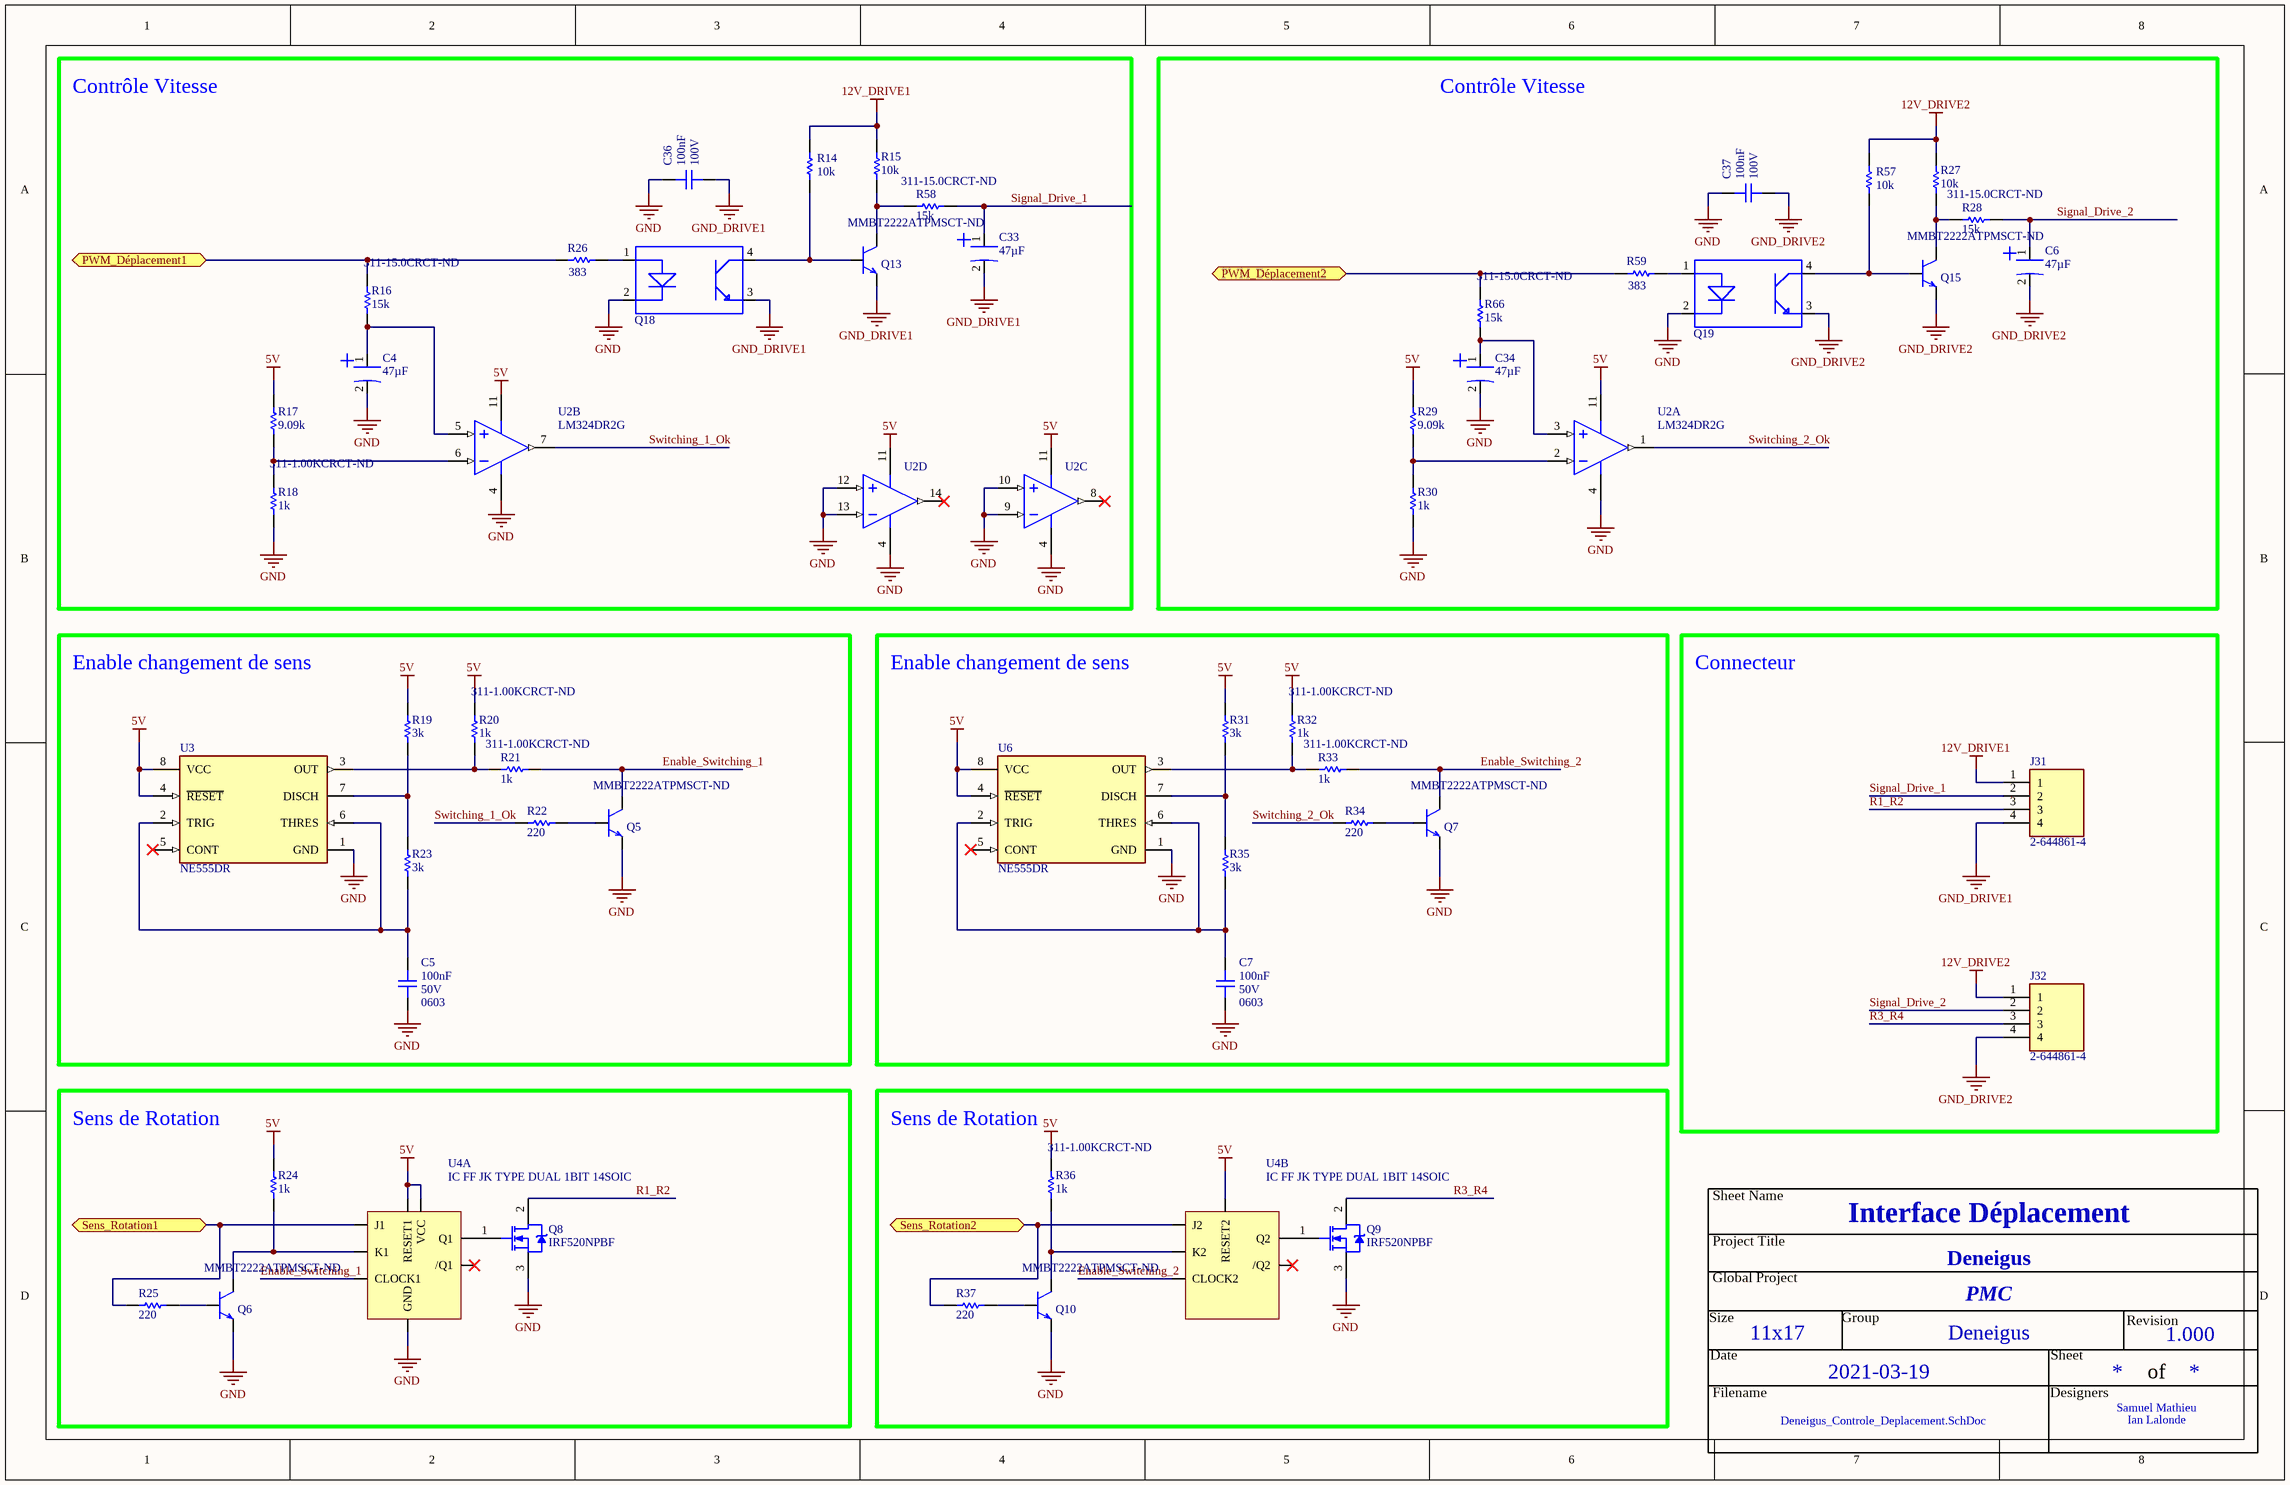
[diagram p4: Deneigus_Controle_Deplacement.SchDoc]

### Parts
C4  value 47µF  [47uF]  (hidden comment: CAP ALUM POLY 47UF 20% 16V SMD)
C5  value 100nF  Voltage: 50V  Package: 0603  [CAP_0603]  (hidden comment: CAP - 0603)
C6  value 47µF  [47uF]  (hidden comment: CAP ALUM POLY 47UF 20% 16V SMD)
C7  value 100nF  Voltage: 50V  Package: 0603  [CAP_0603]  (hidden comment: CAP - 0603)
C33  value 47µF  [47uF]  (hidden comment: CAP ALUM POLY 47UF 20% 16V SMD)
C34  value 47µF  [47uF]  (hidden comment: CAP ALUM POLY 47UF 20% 16V SMD)
C36  value 100nF  Voltage: 100V  [CAP_0805]  (hidden comment: CAP - 0805)
C37  value 100nF  Voltage: 100V  [CAP_0805]  (hidden comment: CAP - 0805)
J31  2-644861-4  [TE_2-644861-4]
J32  2-644861-4  [TE_2-644861-4]
Q5  Supplier Part Number 1: MMBT2222ATPMSCT-ND  [SOT-23]  (hidden comment: TRANS NPN 40V 0.2A SOT23)
Q6  Supplier Part Number 1: MMBT2222ATPMSCT-ND  [SOT-23]  (hidden comment: TRANS NPN 40V 0.2A SOT23)
Q7  Supplier Part Number 1: MMBT2222ATPMSCT-ND  [SOT-23]  (hidden comment: TRANS NPN 40V 0.2A SOT23)
Q8  IRF520NPBF  [INTR-TO-220AB-3]
Q9  IRF520NPBF  [INTR-TO-220AB-3]
Q10  Supplier Part Number 1: MMBT2222ATPMSCT-ND  [SOT-23]  (hidden comment: TRANS NPN 40V 0.2A SOT23)
Q13  Supplier Part Number 1: MMBT2222ATPMSCT-ND  [SOT-23]  (hidden comment: TRANS NPN 40V 0.2A SOT23)
Q15  Supplier Part Number 1: MMBT2222ATPMSCT-ND  [SOT-23]  (hidden comment: TRANS NPN 40V 0.2A SOT23)
Q18  WL-OCPT OPTOCOUPLER PHOTOTRANSIS  [WL-OCPT OPTOCOUPLER PHOTOTRANSIS]  (value not drawn)
Q19  WL-OCPT OPTOCOUPLER PHOTOTRANSIS  [WL-OCPT OPTOCOUPLER PHOTOTRANSIS]  (value not drawn)
R14  value 10k  [RES_0805]  (hidden comment: Res1)
R15  value 10k  [RES_0805]  (hidden comment: Res1)
R16  value 15k  Supplier Part Number 1: 311-15.0CRCT-ND  [RES_0805]  (hidden comment: Res1)
R17  value 9.09k  [RES_0805]  (hidden comment: Res1)
R18  value 1k  Supplier Part Number 1: 311-1.00KCRCT-ND  [RES_0805]  (hidden comment: Res1)
R19  value 3k  [RES_0805]  (hidden comment: Res1)
R20  value 1k  Supplier Part Number 1: 311-1.00KCRCT-ND  [RES_0805]  (hidden comment: Res1)
R21  value 1k  Supplier Part Number 1: 311-1.00KCRCT-ND  [RES_0805]  (hidden comment: Res1)
R22  value 220  [RES_0805]  (hidden comment: Res1)
R23  value 3k  [RES_0805]  (hidden comment: Res1)
R24  value 1k  [RES_0805]  (hidden comment: Res1)
R25  value 220  [RES_0805]  (hidden comment: Res1)
R26  value 383  [RES_0805]  (hidden comment: Res1)
R27  value 10k  [RES_0805]  (hidden comment: Res1)
R28  value 15k  Supplier Part Number 1: 311-15.0CRCT-ND  [RES_0805]  (hidden comment: Res1)
R29  value 9.09k  [RES_0805]  (hidden comment: Res1)
R30  value 1k  [RES_0805]  (hidden comment: Res1)
R31  value 3k  [RES_0805]  (hidden comment: Res1)
R32  value 1k  Supplier Part Number 1: 311-1.00KCRCT-ND  [RES_0805]  (hidden comment: Res1)
R33  value 1k  Supplier Part Number 1: 311-1.00KCRCT-ND  [RES_0805]  (hidden comment: Res1)
R34  value 220  [RES_0805]  (hidden comment: Res1)
R35  value 3k  [RES_0805]  (hidden comment: Res1)
R36  value 1k  Supplier Part Number 1: 311-1.00KCRCT-ND  [RES_0805]  (hidden comment: Res1)
R37  value 220  [RES_0805]  (hidden comment: Res1)
R57  value 10k  [RES_0805]  (hidden comment: Res1)
R58  value 15k  Supplier Part Number 1: 311-15.0CRCT-ND  [RES_0805]  (hidden comment: Res1)
R59  value 383  [RES_0805]  (hidden comment: Res1)
R66  value 15k  Supplier Part Number 1: 311-15.0CRCT-ND  [RES_0805]  (hidden comment: Res1)
U2  LM324DR2G  [ONSC-SOIC-14-751A-03_V]  (parts A,B,C,D of 4)
U3  NE555DR  [FP-D0008A-IPC_A]
U4  IC FF JK TYPE DUAL 1BIT 14SOIC  [SOIC127P600X175-14N]  (parts A,B of 2)
U6  NE555DR  [FP-D0008A-IPC_A]

### Blocks framed on the sheet
Contrôle Vitesse: C4 C33 C36 Q13 Q18 R14-R18 R26 R58 U2
Contrôle Vitesse: C6 C34 C37 Q15 Q19 R27-R30 R57 R59 R66 U2
Enable changement de sens: C5 Q5 R19-R23 U3
Enable changement de sens: C7 Q7 R31-R35 U6
Connecteur: J31 J32
Sens de Rotation: Q6 Q8 R24 R25 U4
Sens de Rotation: Q9 Q10 R36 R37 U4

### Ports
PWM_Déplacement1 (bidir), PWM_Déplacement2 (bidir), Sens_Rotation1 (bidir), Sens_Rotation2 (bidir)

### Nets
5V: R17.2 R19.2 R20.2 R24.2 R29.2 R31.2 R32.2 R36.2 U2.11(VEE/GND) U3.4(~{RESET}) U3.8(VCC) U4.2(RESET1) U4.4(VCC) U4.6(RESET2) U6.4(~{RESET}) U6.8(VCC)
12V_DRIVE1: J31.1 R14.1 R15.2
12V_DRIVE2: J32.1 R27.2 R57.1
GND: C4.2 C5.1 C7.1 C34.2 C36.2 C37.2 Q5.2 Q6.2 Q7.2 Q8.3(S) Q9.3(S) Q10.2 Q18.2 Q19.2 R18.1 R30.1 U2.4(VCC) U2.9(IN3-) U2.10(IN3+) U2.12(IN4+) U2.13(IN4-) U3.1(GND) U4.11(GND) U6.1(GND)
GND_DRIVE1: C33.2 C36.1 J31.4 Q13.2 Q18.3
GND_DRIVE2: C6.2 C37.1 J32.4 Q15.2 Q19.3
Enable_Switching_1: Q5.3 R21.2 U4.1(CLOCK1)
Enable_Switching_2: Q7.3 R33.2 U4.5(CLOCK2)
PWM_Déplacement1: R16.1 R26.1 ; port PWM_Déplacement1
PWM_Déplacement2: R59.1 R66.1 ; port PWM_Déplacement2
R1_R2: J31.3 Q8.2(D)
R3_R4: J32.3 Q9.2(D)
Sens_Rotation1: R25.1 U4.14(J1) ; port Sens_Rotation1
Sens_Rotation2: R37.1 U4.7(J2) ; port Sens_Rotation2
Signal_Drive_1: C33.1 J31.2 R58.2
Signal_Drive_2: C6.1 J32.2 R28.2
Switching_1_Ok: R22.1 U2.7(OUT2)
Switching_2_Ok: R34.1 U2.1(OUT1)
NetC4_1: C4.1 R16.2 U2.5(IN2+)
NetC5_2: C5.2 R23.1 U3.2(TRIG) U3.6(THRES)
NetC7_2: C7.2 R35.1 U6.2(TRIG) U6.6(THRES)
NetC34_1: C34.1 R66.2 U2.3(IN1+)
NetQ5_1: Q5.1 R22.2
NetQ6_1: Q6.1 R25.2
NetQ6_3: Q6.3 R24.1 U4.3(K1)
NetQ7_1: Q7.1 R34.2
NetQ8_1: Q8.1(G) U4.12(Q1)
NetQ9_1: Q9.1(G) U4.9(Q2)
NetQ10_1: Q10.1 R37.2
NetQ10_3: Q10.3 R36.1 U4.10(K2)
NetQ13_1: Q13.1 Q18.4 R14.2
NetQ13_3: Q13.3 R15.1 R58.1
NetQ15_1: Q15.1 Q19.4 R57.2
NetQ15_3: Q15.3 R27.1 R28.1
NetQ18_1: Q18.1 R26.2
NetQ19_1: Q19.1 R59.2
NetR17_1: R17.1 R18.2 U2.6(IN2-)
NetR19_1: R19.1 R23.2 U3.7(DISCH)
NetR20_1: R20.1 R21.1 U3.3(OUT)
NetR29_1: R29.1 R30.2 U2.2(IN1-)
NetR31_1: R31.1 R35.2 U6.7(DISCH)
NetR32_1: R32.1 R33.1 U6.3(OUT)

Not connected (* = marked no-connect by the designer): U2 8(OUT3)* 14(OUT4)*; U3 5(CONT)*; U4 8(/Q2)* 13(/Q1)*; U6 5(CONT)*

### Notes on the sheet
- Sheet Name
- Project Title
- Global Project
- Revision
- Size
- Date
- Group
- Sheet
- of
- Filename
- Designers

### Library data of the parts
C4 C6 C33 C34 = 47µF SMD: as C1 on sheet Deneigus_Controle_Soufflante; Supplier 1: Digikey; Supplier Part Number 1: 732-6421-2-ND; HelpURL: https://www.we-online.de/katalog/datasheet/875105344006.pdf
C5 C7 = CAP - 0603: Precision: 10%; Current: *; CreatedBy: Jonathan Bouchard; Power: *
C36 C37 = CAP - 0805: as C35 on sheet Deneigus_Controle_Soufflante; Current: *; CreatedBy: Jonathan Bouchard; Power: *; Package: 0805; Supplier 1: Digi-Key; Supplier Part Number 1: 490-5825-1-ND
J31 J32 = 2-644861-4: Connector Header Through Hole 4 position 0.100 (2.54mm); MF: TE Connectivity; Availability: Good; Value: *; Check_prices: https://www.snapeda.com/parts/2-644861-4/TE%20Connectivity%20AMP%20Connectors/view-part/2876279/?ref=eda; Package: None; Price: None; MP: 2-644861-4; SnapEDA_Link: https://www.snapeda.com/parts/2-644861-4/TE%20Connectivity%20AMP%20Connectors/view-part/2876279/?ref=snap; Purchase-URL: https://pricing.snapeda.com/search/part/2-644861-4/?ref=eda
Q5-Q7 Q10 Q13 Q15 = NPN 3904 SMD: as Q4 on sheet Deneigus_Controle_Soufflante; RoHS: Yes; Category: BJTs; Stock 1: 949449; Pricing 1: 1=0.10000, 10=0.08100, 25=0.07680, 100=0.04400, 500=0.02706, 1000=0.01844 (USD); Mount: Surface Mount; Case/Package: SOT-23; Number of Pins: 3; Min Operating Temperature: -55°C; Max Operating Temperature: 150°C; Package Quantity: 1; Collector Emitter Voltage (VCEO): 40V; Packaging: Tape and Reel; Max Collector Current: 200mA; Transition Frequency: 300MHz; Collector Emitter Breakdown Voltage: 40V; Polarity: NPN; Max Breakdown Voltage: 40V; Power Dissipation: 350mW; Max Frequency: 300MHz; Gain Bandwidth Product: 300MHz; Voltage Rating (DC): 40V; Series: -; Collector-emitter Voltage-Max: 300mV; Length: 3.04mm; Width: 1.4mm; Height: 1.12mm; Radiation Hardening: No; Lead Free: Lead Free; RoHS Compliant: Yes; ComponentLink1URL: https://datasheet.ciiva.com/972/mmbt3904sot-23-972515.pdf?src-supplier=Digi-Key; ComponentLink1Description: https://datasheet.ciiva.com/972/mmbt3904sot-23-972515.pdf?src-supplier=Digi-Key; ComponentLink2URL: https://datasheet.ciiva.com/16291/mmbt3904sot-23-37005-16291911.pdf?src-supplier=Mouser; ComponentLink2Description: https://datasheet.ciiva.com/16291/mmbt3904sot-23-37005-16291911.pdf?src-supplier=Mouser; ComponentLink3URL: https://datasheet.ciiva.com/15139/getdatasheetpartid-251950-15139820.pdf?src-supplier=Verical; ComponentLink3Description: https://datasheet.ciiva.com/15139/getdatasheetpartid-251950-15139820.pdf?src-supplier=Verical; ComponentLink4URL: https://datasheet.ciiva.com/972/mmbt3904sot-23-972516.pdf?src-supplier=Digi-Key; ComponentLink4Description: https://datasheet.ciiva.com/972/mmbt3904sot-23-972516.pdf?src-supplier=Digi-Key; ComponentLink5URL: https://datasheet.ciiva.com/16742/mmbt3904tsot-523-16742101.pdf?src-supplier=Future+Electronics; ComponentLink5Description: https://datasheet.ciiva.com/16742/mmbt3904tsot-523-16742101.pdf?src-supplier=Future+Electronics; ComponentLink6URL: https://datasheet.ciiva.com/14546/70055699-14546053.pdf?src-supplier=Allied+Electronics; ComponentLink6Description: https://datasheet.ciiva.com/14546/70055699-14546053.pdf?src-supplier=Allied+Electronics; Supplier 1: Digi-Key
Q8 Q9 = CMP-013-00017-4: as Q11 on sheet Deneigus_POWER; Package Reference: TO-220AB; Max Operating Temperature: 175°C; Datasheet Version: Nov-03; Datasheet URL: http://www.infineon.com/dgdl/irf520npbf.pdf?fileId=5546d462533600a4015355e340711985; Package Quantity: 50; Package Description: 3-Pin Flange Mount, Body 4.445 x 10.415 mm, Pitch 2.54 mm; Pins: 3; Packaging: Rail/Tube; RoHS Compliant: True; Min Operating Temperature: -55°C; Case/Package: TO-220-3; Mounting Technology: TH
Q18 Q19 = WL-OCPT OPTOCOUPLER PHOTOTRANSIS: as Q14 on sheet Deneigus_Controle_Soufflante; Supplier 1: Digi-Key; Supplier Part Number 1: 732-140357145400CT-ND
R14-R37 R57-R59 R66 = Res1: Resistor; Published: 8-Jun-2000; LatestRevisionDate: 17-Jul-2002; LatestRevisionNote: Re-released for DXP Platform.; PackageReference: AXIAL-0.3; Publisher: Altium Limited; PackageDescription: Axial Device, Thru-Hole; 2 Leads; 0.3 in Pin Spacing
  R16 R18 R20 R21 R28 R32 R33 R36 R58 R66: Supplier 1: Digi-Key
  R24: Supplier 1: Digi-Key; Supplier Part Number 1: RMCF0805FT1K00CT-ND
U2 = CMP-1310-00171-1: Single Supply Quad Operational Amplifier, 3 to 32 V, 0 to 70 degC, 14-Pin SOIC, Pb-Free, Tape and Reel; Manufacturer: On Semiconductor; VCC Max (V): 32; VCC Min (V): 3; PackageVersion: Rev. K, 05/2011; ComponentLink3URL: http://www.onsemi.com/pub_link/Collateral/751A-03.PDF; ComponentLink3Description: Package Specification; Packing: Tape and Reel; ComponentLink2URL: http://www.onsemi.cn/pub_link/Collateral/LM324-D.PDF; PackageReference: SOIC-14-751A-03; ComponentLink1URL: http://www.onsemi.com/; PackageDescription: 14-Pin Small Outline Integrated Circuit, Body 8.65 x 3.9 mm, Pitch 1.27 mm; ComponentLink1Description: Manufacturer URL; DatasheetVersion: Rev. 25; Mounting Technology: Surface Mount; RoHS: TRUE; ComponentLink2Description: Datasheet; PartNumber: LM324DR2G
U3 U6 = CMP-1685-00007-2: IC OSC SGL TIMER 100KHZ 8-SOIC; Low Level Output Current: 200mA; Quiescent Current: 15mA; Min Supply Voltage: 4.5V; Number of Timers/Counters: 1; Max Supply Voltage: 16V; Operating Supply Current: 10mA; High Level Output Current: -200mA; Packaging: Tape and Reel; Frequency: 100kHz; Weight: 0.002561oz; REACH SVHC: No SVHC; Package Quantity: 2500; Width: 3.91mm; Max Operating Temperature: 70°C; Contact Plating: Gold; Lead Free: Lead Free; Number of Pins: 8; Min Operating Temperature: 0°C; Radiation Hardening: No; Length: 4.9mm; Case/Package: SOIC; Height: 1.58mm; Mount: Surface Mount
U4 = Dual JK flip-flop: Flip Flop Element JK Type Bit Negative Edge 14-SOIC (0.154", 3.90mm Width); Supplier 1: Digi-Key; Supplier Part Number 1: 296-14540-1-ND

## Sheet Deneigus_Sensors.SchDoc
size Tabloid; Sheet_Name: Sensors; Size: 11x17
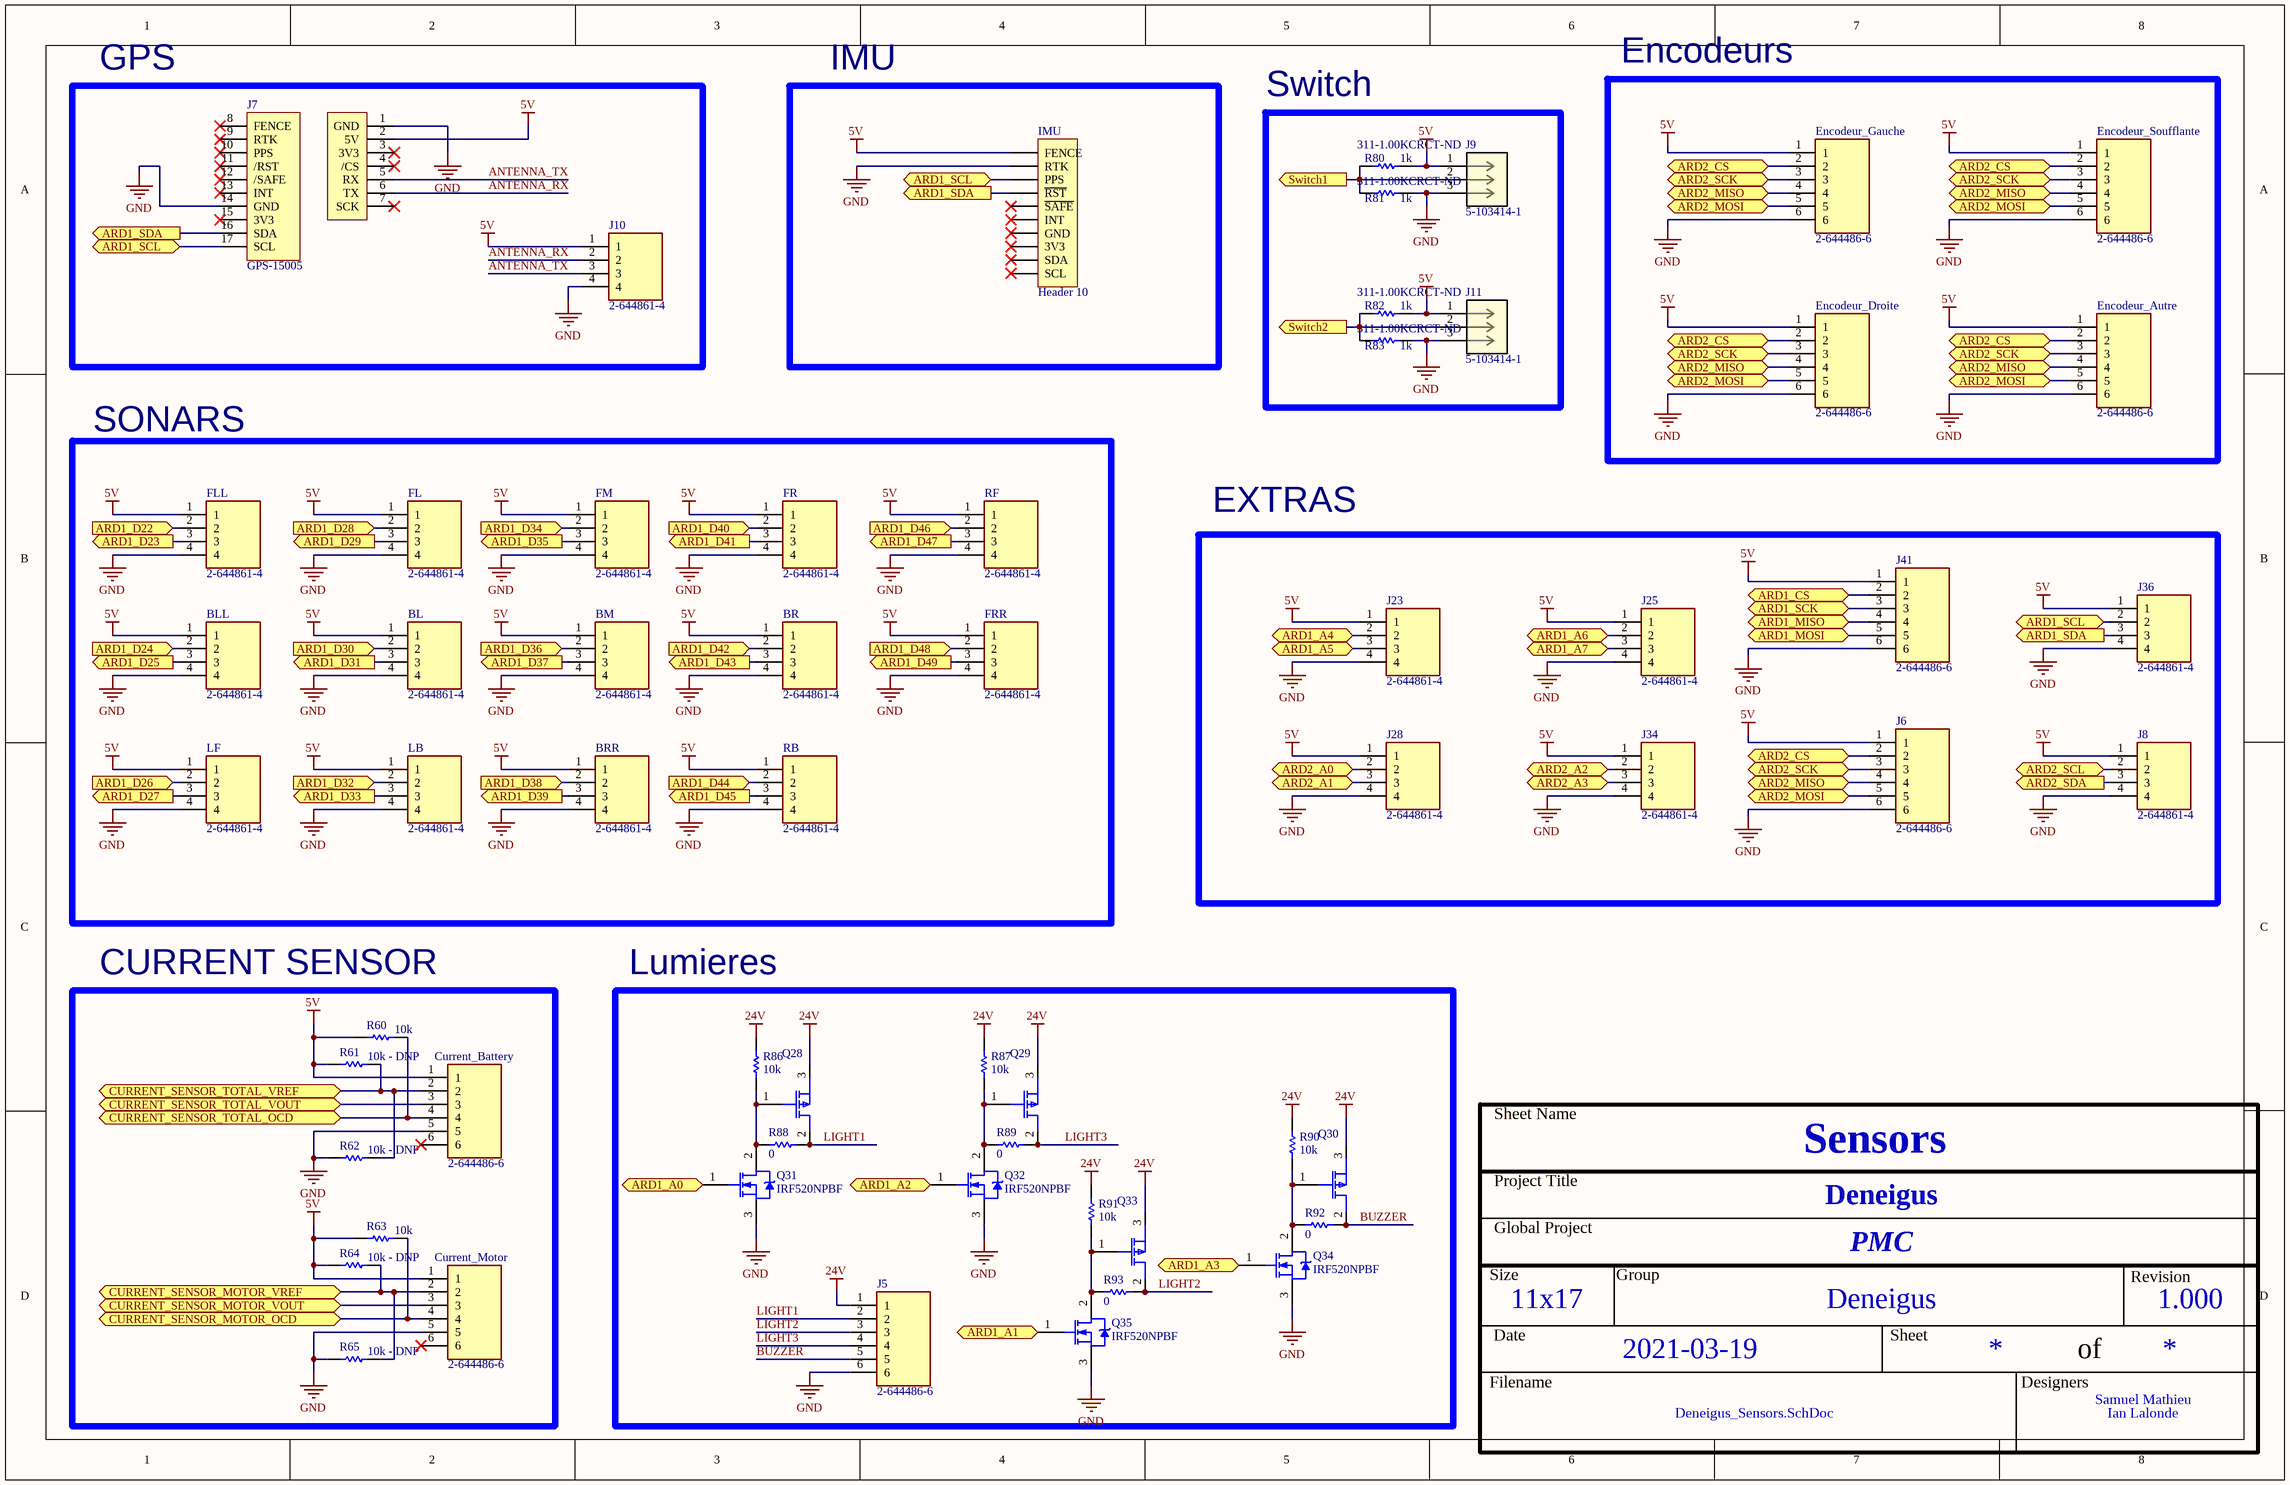
[diagram p5: Deneigus_Sensors.SchDoc]

### Parts
BL  2-644861-4  [TE_2-644861-4]
BLL  2-644861-4  [TE_2-644861-4]
BM  2-644861-4  [TE_2-644861-4]
BR  2-644861-4  [TE_2-644861-4]
BRR  2-644861-4  [TE_2-644861-4]
Current_Battery  2-644486-6  [TE_2-644486-6]
Current_Motor  2-644486-6  [TE_2-644486-6]
Encodeur_Autre  2-644486-6  [TE_2-644486-6]
Encodeur_Droite  2-644486-6  [TE_2-644486-6]
Encodeur_Gauche  2-644486-6  [TE_2-644486-6]
Encodeur_Soufflante  2-644486-6  [TE_2-644486-6]
FL  2-644861-4  [TE_2-644861-4]
FLL  2-644861-4  [TE_2-644861-4]
FM  2-644861-4  [TE_2-644861-4]
FR  2-644861-4  [TE_2-644861-4]
FRR  2-644861-4  [TE_2-644861-4]
IMU  Header 10  [HDR1X10]
J5  2-644486-6  [TE_2-644486-6]
J6  2-644486-6  [TE_2-644486-6]
J7  GPS-15005  [GPS_PFB]
J8  2-644861-4  [TE_2-644861-4]
J9  5-103414-1  [CONN_5-103414-1_TYCO]
J10  2-644861-4  [TE_2-644861-4]
J11  5-103414-1  [CONN_5-103414-1_TYCO]
J23  2-644861-4  [TE_2-644861-4]
J25  2-644861-4  [TE_2-644861-4]
J28  2-644861-4  [TE_2-644861-4]
J34  2-644861-4  [TE_2-644861-4]
J36  2-644861-4  [TE_2-644861-4]
J41  2-644486-6  [TE_2-644486-6]
LB  2-644861-4  [TE_2-644861-4]
LF  2-644861-4  [TE_2-644861-4]
Q28  MOSFET P-CH 55V 12A TO220AB  [IRF9Z24NPBF]  (value not drawn)
Q29  MOSFET P-CH 55V 12A TO220AB  [IRF9Z24NPBF]  (value not drawn)
Q30  MOSFET P-CH 55V 12A TO220AB  [IRF9Z24NPBF]  (value not drawn)
Q31  IRF520NPBF  [INTR-TO-220AB-3]
Q32  IRF520NPBF  [INTR-TO-220AB-3]
Q33  MOSFET P-CH 55V 12A TO220AB  [IRF9Z24NPBF]  (value not drawn)
Q34  IRF520NPBF  [INTR-TO-220AB-3]
Q35  IRF520NPBF  [INTR-TO-220AB-3]
R60  value 10k  [RES_0805]  (hidden comment: Res1)
R61  value 10k - DNP  [RES_0805]  (hidden comment: Res1)
R62  value 10k - DNP  [RES_0805]  (hidden comment: Res1)
R63  value 10k  [RES_0805]  (hidden comment: Res1)
R64  value 10k - DNP  [RES_0805]  (hidden comment: Res1)
R65  value 10k - DNP  [RES_0805]  (hidden comment: Res1)
R80  value 1k  Supplier Part Number 1: 311-1.00KCRCT-ND  [RES_0805]  (hidden comment: RES - 0805)
R81  value 1k  Supplier Part Number 1: 311-1.00KCRCT-ND  [RES_0805]  (hidden comment: RES - 0805)
R82  value 1k  Supplier Part Number 1: 311-1.00KCRCT-ND  [RES_0805]  (hidden comment: RES - 0805)
R83  value 1k  Supplier Part Number 1: 311-1.00KCRCT-ND  [RES_0805]  (hidden comment: RES - 0805)
R86  value 10k  [RES_0805]  (hidden comment: Res1)
R87  value 10k  [RES_0805]  (hidden comment: Res1)
R88  value 0  [RES_0805]  (hidden comment: Res1)
R89  value 0  [RES_0805]  (hidden comment: Res1)
R90  value 10k  [RES_0805]  (hidden comment: Res1)
R91  value 10k  [RES_0805]  (hidden comment: Res1)
R92  value 0  [RES_0805]  (hidden comment: Res1)
R93  value 0  [RES_0805]  (hidden comment: Res1)
RB  2-644861-4  [TE_2-644861-4]
RF  2-644861-4  [TE_2-644861-4]

### Blocks framed on the sheet
GPS: J7 J10
IMU: IMU
Switch: J9 J11 R80-R83
Encodeurs: Encodeur_Autre Encodeur_Droite Encodeur_Gauche Encodeur_Soufflante
SONARS: BL BLL BM BR BRR FL FLL FM FR FRR LB LF RB RF
EXTRAS: J6 J8 J23 J25 J28 J34 J36 J41
CURRENT SENSOR: Current_Battery Current_Motor R60-R65
Lumieres: J5 Q28-Q35 R86-R93

### Ports
ARD1_A0 (bidir), ARD1_A1 (bidir), ARD1_A2 (bidir), ARD1_A3 (bidir), ARD1_A4 (bidir), ARD1_A5 (bidir), ARD1_A6 (bidir), ARD1_A7 (bidir), ARD1_CS (bidir), ARD1_D22 (in), ARD1_D23 (out), ARD1_D24 (in), ARD1_D25 (out), ARD1_D26 (in), ARD1_D27 (out), ARD1_D28 (in), ARD1_D29 (out), ARD1_D30 (in), ARD1_D31 (out), ARD1_D32 (in), ARD1_D33 (out), ARD1_D34 (in), ARD1_D35 (out), ARD1_D36 (in), ARD1_D37 (out), ARD1_D38 (in), ARD1_D39 (out), ARD1_D40 (in), ARD1_D41 (out), ARD1_D42 (in), ARD1_D43 (out), ARD1_D44 (in), ARD1_D45 (out), ARD1_D46 (in), ARD1_D47 (out), ARD1_D48 (in), ARD1_D49 (out), ARD1_MISO (bidir), ARD1_MOSI (bidir), ARD1_SCK (bidir), ARD1_SCL (bidir), ARD1_SDA (out), ARD2_A0 (bidir), ARD2_A1 (bidir), ARD2_A2 (bidir), ARD2_A3 (bidir), ARD2_CS (bidir), ARD2_MISO (bidir), ARD2_MOSI (bidir), ARD2_SCK (bidir), ARD2_SCL (bidir), ARD2_SDA (out), CURRENT_SENSOR_MOTOR_OCD (bidir), CURRENT_SENSOR_MOTOR_VOUT (bidir), CURRENT_SENSOR_MOTOR_VREF (bidir), CURRENT_SENSOR_TOTAL_OCD (bidir), CURRENT_SENSOR_TOTAL_VOUT (bidir), CURRENT_SENSOR_TOTAL_VREF (bidir), Switch1 (out), Switch2 (out)

### Nets
5V: BL.1 BLL.1 BM.1 BR.1 BRR.1 Current_Battery.1 Current_Motor.1 Encodeur_Autre.1 Encodeur_Droite.1 Encodeur_Gauche.1 Encodeur_Soufflante.1 FL.1 FLL.1 FM.1 FR.1 FRR.1 IMU.1(FENCE) J6.1 J7.2(5V) J8.1 J9.1 J10.1 J11.1 J23.1 J25.1 J28.1 J34.1 J36.1 J41.1 LB.1 LF.1 R60.2 R61.2 R63.2 R64.2 R80.2 R82.2 RB.1 RF.1
24V: J5.1 Q28.3(Source) Q29.3(Source) Q30.3(Source) Q33.3(Source) R86.1 R87.1 R90.1 R91.1
GND: BL.4 BLL.4 BM.4 BR.4 BRR.4 Current_Battery.5 Current_Motor.5 Encodeur_Autre.6 Encodeur_Droite.6 Encodeur_Gauche.6 Encodeur_Soufflante.6 FL.4 FLL.4 FM.4 FR.4 FRR.4 IMU.2(RTK) J5.6 J6.6 J7.1(GND) J7.14(GND) J8.4 J9.3 J10.4 J11.3 J23.4 J25.4 J28.4 J34.4 J36.4 J41.6 LB.4 LF.4 Q31.3(S) Q32.3(S) Q34.3(S) Q35.3(S) R62.2 R65.2 R81.1 R83.1 RB.4 RF.4
ANTENNA_RX: J7.6(TX) J10.2
ANTENNA_TX: J7.5(RX) J10.3
ARD1_A0: Q31.1(G) ; port ARD1_A0
ARD1_A1: Q35.1(G) ; port ARD1_A1
ARD1_A2: Q32.1(G) ; port ARD1_A2
ARD1_A3: Q34.1(G) ; port ARD1_A3
ARD1_A4: J23.2 ; port ARD1_A4
ARD1_A5: J23.3 ; port ARD1_A5
ARD1_A6: J25.2 ; port ARD1_A6
ARD1_A7: J25.3 ; port ARD1_A7
ARD1_CS: J41.2 ; port ARD1_CS
ARD1_D22: FLL.2 ; port ARD1_D22
ARD1_D23: FLL.3 ; port ARD1_D23
ARD1_D24: BLL.2 ; port ARD1_D24
ARD1_D25: BLL.3 ; port ARD1_D25
ARD1_D26: LF.2 ; port ARD1_D26
ARD1_D27: LF.3 ; port ARD1_D27
ARD1_D28: FL.2 ; port ARD1_D28
ARD1_D29: FL.3 ; port ARD1_D29
ARD1_D30: BL.2 ; port ARD1_D30
ARD1_D31: BL.3 ; port ARD1_D31
ARD1_D32: LB.2 ; port ARD1_D32
ARD1_D33: LB.3 ; port ARD1_D33
ARD1_D34: FM.2 ; port ARD1_D34
ARD1_D35: FM.3 ; port ARD1_D35
ARD1_D36: BM.2 ; port ARD1_D36
ARD1_D37: BM.3 ; port ARD1_D37
ARD1_D38: BRR.2 ; port ARD1_D38
ARD1_D39: BRR.3 ; port ARD1_D39
ARD1_D40: FR.2 ; port ARD1_D40
ARD1_D41: FR.3 ; port ARD1_D41
ARD1_D42: BR.2 ; port ARD1_D42
ARD1_D43: BR.3 ; port ARD1_D43
ARD1_D44: RB.2 ; port ARD1_D44
ARD1_D45: RB.3 ; port ARD1_D45
ARD1_D46: RF.2 ; port ARD1_D46
ARD1_D47: RF.3 ; port ARD1_D47
ARD1_D48: FRR.2 ; port ARD1_D48
ARD1_D49: FRR.3 ; port ARD1_D49
ARD1_MISO: J41.4 ; port ARD1_MISO
ARD1_MOSI: J41.5 ; port ARD1_MOSI
ARD1_SCK: J41.3 ; port ARD1_SCK
ARD1_SCL: IMU.3(PPS) J7.17(SCL) J36.2 ; port ARD1_SCL
ARD1_SDA: IMU.4(~{RST}) J7.16(SDA) J36.3 ; port ARD1_SDA
ARD2_A0: J28.2 ; port ARD2_A0
ARD2_A1: J28.3 ; port ARD2_A1
ARD2_A2: J34.2 ; port ARD2_A2
ARD2_A3: J34.3 ; port ARD2_A3
ARD2_CS: Encodeur_Autre.2 Encodeur_Droite.2 Encodeur_Gauche.2 Encodeur_Soufflante.2 J6.2 ; port ARD2_CS
ARD2_MISO: Encodeur_Autre.4 Encodeur_Droite.4 Encodeur_Gauche.4 Encodeur_Soufflante.4 J6.4 ; port ARD2_MISO
ARD2_MOSI: Encodeur_Autre.5 Encodeur_Droite.5 Encodeur_Gauche.5 Encodeur_Soufflante.5 J6.5 ; port ARD2_MOSI
ARD2_SCK: Encodeur_Autre.3 Encodeur_Droite.3 Encodeur_Gauche.3 Encodeur_Soufflante.3 J6.3 ; port ARD2_SCK
ARD2_SCL: J8.2 ; port ARD2_SCL
ARD2_SDA: J8.3 ; port ARD2_SDA
BUZZER: J5.5 Q30.2(Drain) R92.2
CURRENT_SENSOR_MOTOR_OCD: Current_Motor.4 R63.1 ; port CURRENT_SENSOR_MOTOR_OCD
CURRENT_SENSOR_MOTOR_VOUT: Current_Motor.3 ; port CURRENT_SENSOR_MOTOR_VOUT
CURRENT_SENSOR_MOTOR_VREF: Current_Motor.2 R64.1 R65.1 ; port CURRENT_SENSOR_MOTOR_VREF
CURRENT_SENSOR_TOTAL_OCD: Current_Battery.4 R60.1 ; port CURRENT_SENSOR_TOTAL_OCD
CURRENT_SENSOR_TOTAL_VOUT: Current_Battery.3 ; port CURRENT_SENSOR_TOTAL_VOUT
CURRENT_SENSOR_TOTAL_VREF: Current_Battery.2 R61.1 R62.1 ; port CURRENT_SENSOR_TOTAL_VREF
LIGHT1: J5.2 Q28.2(Drain) R88.2
LIGHT2: J5.3 Q33.2(Drain) R93.2
LIGHT3: J5.4 Q29.2(Drain) R89.2
Switch1: J9.2 R80.1 R81.2 ; port Switch1
Switch2: J11.2 R82.1 R83.2 ; port Switch2
NetQ28_1: Q28.1(Gate) Q31.2(D) R86.2 R88.1
NetQ29_1: Q29.1(Gate) Q32.2(D) R87.2 R89.1
NetQ30_1: Q30.1(Gate) Q34.2(D) R90.2 R92.1
NetQ33_1: Q33.1(Gate) Q35.2(D) R91.2 R93.1

Not connected (* = marked no-connect by the designer): Current_Battery 6*; Current_Motor 6*; IMU 5(~{SAFE})* 6(INT)* 7(GND)* 8(3V3)* 9(SDA)* 10(SCL)*; J7 3(3V3)* 4(/CS)* 7(SCK)* 8(FENCE)* 9(RTK)* 10(PPS)* 11(/RST)* 12(/SAFE)* 13(INT)* 15(3V3)*

### Notes on the sheet
- Sheet Name
- Project Title
- Global Project
- Size
- Group
- Revision
- Date
- Sheet
- of
- Filename
- Designers

### Library data of the parts
BL BLL BM BR BRR FL FLL FM FR FRR J8 J10 J23 J25 J28 J34 J36 LB LF RB RF = 2-644861-4: as J31 on sheet Deneigus_Controle_Deplacement; Availability: Good; Value: *; Check_prices: https://www.snapeda.com/parts/2-644861-4/TE%20Connectivity%20AMP%20Connectors/view-part/2876279/?ref=eda; Package: None; Price: None; MP: 2-644861-4; SnapEDA_Link: https://www.snapeda.com/parts/2-644861-4/TE%20Connectivity%20AMP%20Connectors/view-part/2876279/?ref=snap; Purchase-URL: https://pricing.snapeda.com/search/part/2-644861-4/?ref=eda
Current_Battery Current_Motor Encodeur_Autre Encodeur_Droite Encodeur_Gauche Encodeur_Soufflante J5 J6 J41 = 2-644486-6: 06P MTA100 SHRDED HDR ASSY SN; MF: TE Connectivity; DigiKey-Purchase-URL: https://snapeda.com/shop?store=DigiKey&id=2876038; Mouser-Purchase-URL: https://snapeda.com/shop?store=Mouser&id=2876038; SnapEDA_Link: https://www.snapeda.com/parts/2-644486-6/TE%20Connectivity%20AMP%20Connectors/view-part/2876038/?ref=snap; Digi-Key_Part_Number: A30896-ND; MP: 2-644486-6; Value: *; Package: None; Supplier 1: Digikey; Supplier Part Number 1: A30896-ND
IMU = Header 10: Header, 10-Pin; LatestRevisionDate: 17-Jul-2002; LatestRevisionNote: Re-released for DXP Platform.; Publisher: Altium Limited; Supplier 1: Digikey; Supplier Part Number 1: 732-2670-ND
J7 = GPS_PFB: Supplier 1: Digi-Key; Supplier Part Number 1: 1568-1970-ND
J9 J11 = 5-103414-1: No Description Available; Vendor: TE Connectivity; Built_By: EMA_UL_Team; SourceLibrary: Tyco_2012-1-03; Manufacturer_Part_Number: 5-103414-1; Copyright: Copyright (C) 2016 Accelerated Designs. All rights reserved; RefDes: RefDes; Type: DEV; Supplier 1: Digikey; Supplier Part Number 1: A32977-ND
Q28-Q30 Q33 = IRF9Z24NPBF: Supplier 1: Digikey; Supplier Part Number 1: IRF9Z24NPBF-ND
Q31 Q32 Q34 Q35 = CMP-013-00017-4: as Q11 on sheet Deneigus_POWER; Package Reference: TO-220AB; Max Operating Temperature: 175°C; Datasheet Version: Nov-03; Datasheet URL: http://www.infineon.com/dgdl/irf520npbf.pdf?fileId=5546d462533600a4015355e340711985; Package Quantity: 50; Package Description: 3-Pin Flange Mount, Body 4.445 x 10.415 mm, Pitch 2.54 mm; Pins: 3; Packaging: Rail/Tube; RoHS Compliant: True; Min Operating Temperature: -55°C; Case/Package: TO-220-3; Mounting Technology: TH
R60-R65 R86-R93 = Res1: Resistor; Published: 8-Jun-2000; LatestRevisionDate: 17-Jul-2002; LatestRevisionNote: Re-released for DXP Platform.; PackageReference: AXIAL-0.3; Publisher: Altium Limited; PackageDescription: Axial Device, Thru-Hole; 2 Leads; 0.3 in Pin Spacing
  R86-R93: Supplier 1: digikey; Supplier Part Number 1: RNCP0805FTD10K0CT-ND
R80-R83 = RES - 0805: Precision: 1%; Current: *; CreatedBy: Jonathan Bouchard; Package: 0805; Supplier 1: Digi-Key